# EasyEDA Pro project ProPrj_立创·庐山派K230开发板-MIPI转HDMI扩展板.epro

# Schematic 原理图

## Sheets
1 Interface&Power: Board Name: 【1】K230开发板-HDMI扩展板; Create Date: 2024-07-29; Page Name: Interface&Power; Project Name: 【K230】开发板; Schematic Name: HDMI扩展板原理图; Update Date: 2024-09-26
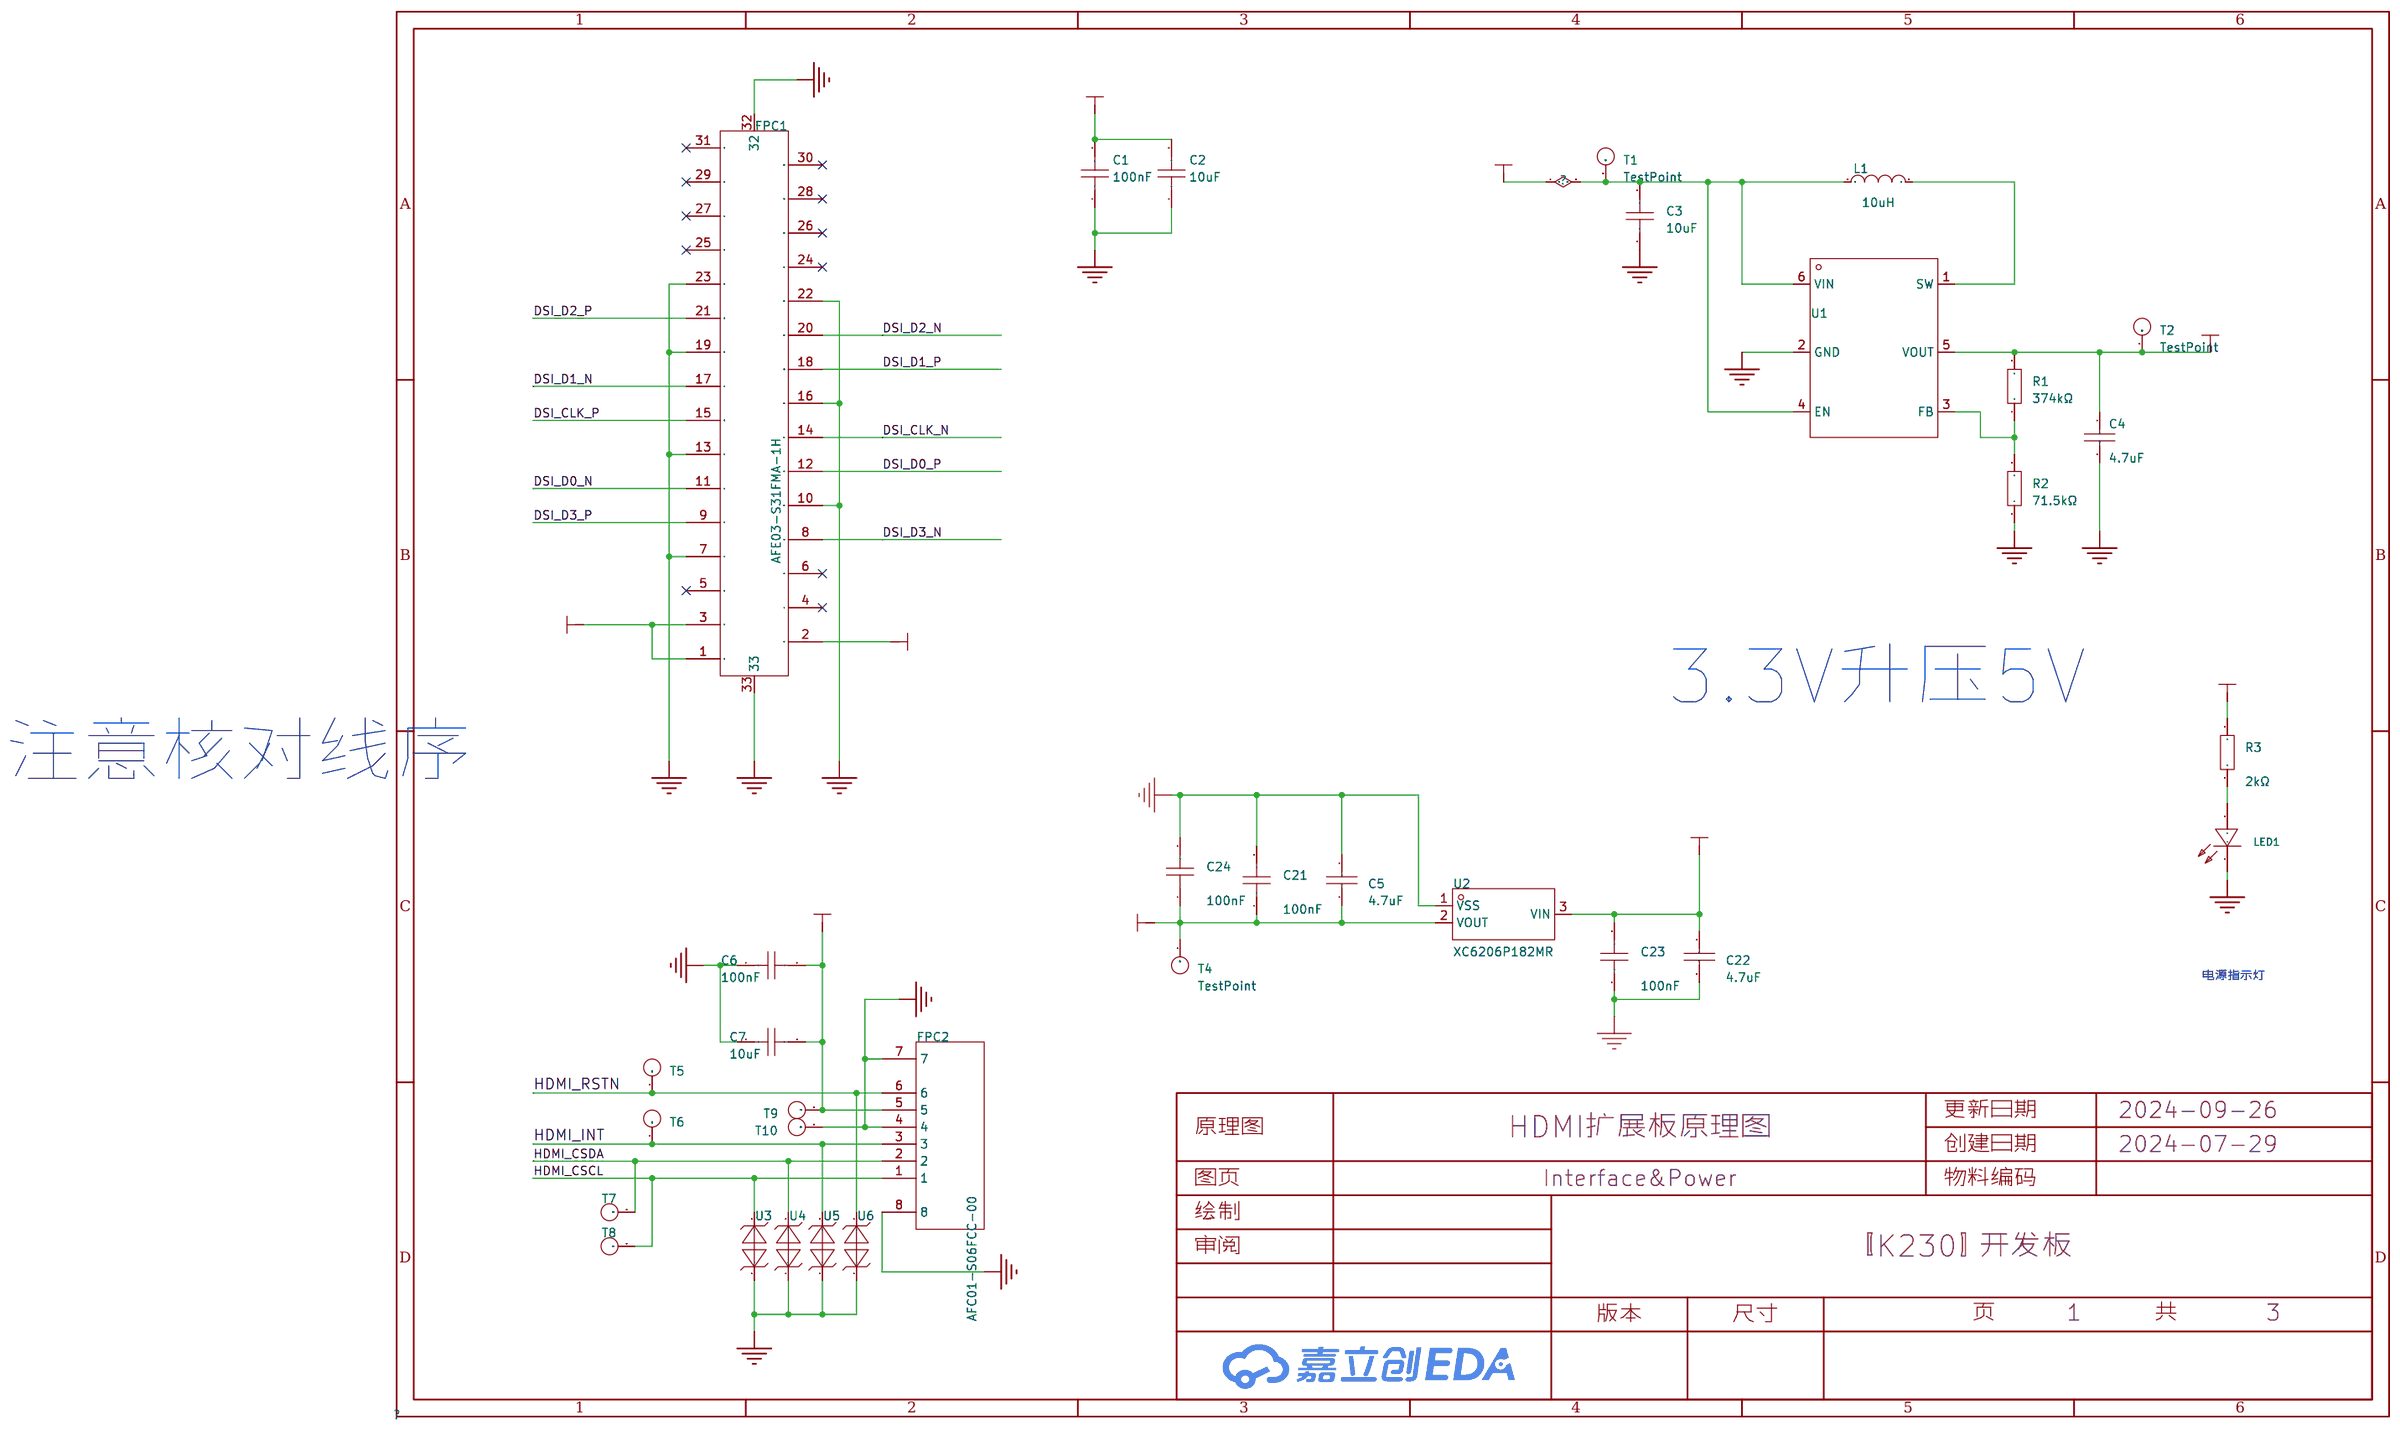
[diagram p0: Interface&Power]
2 LT9611: Create Date: 2024-08-09
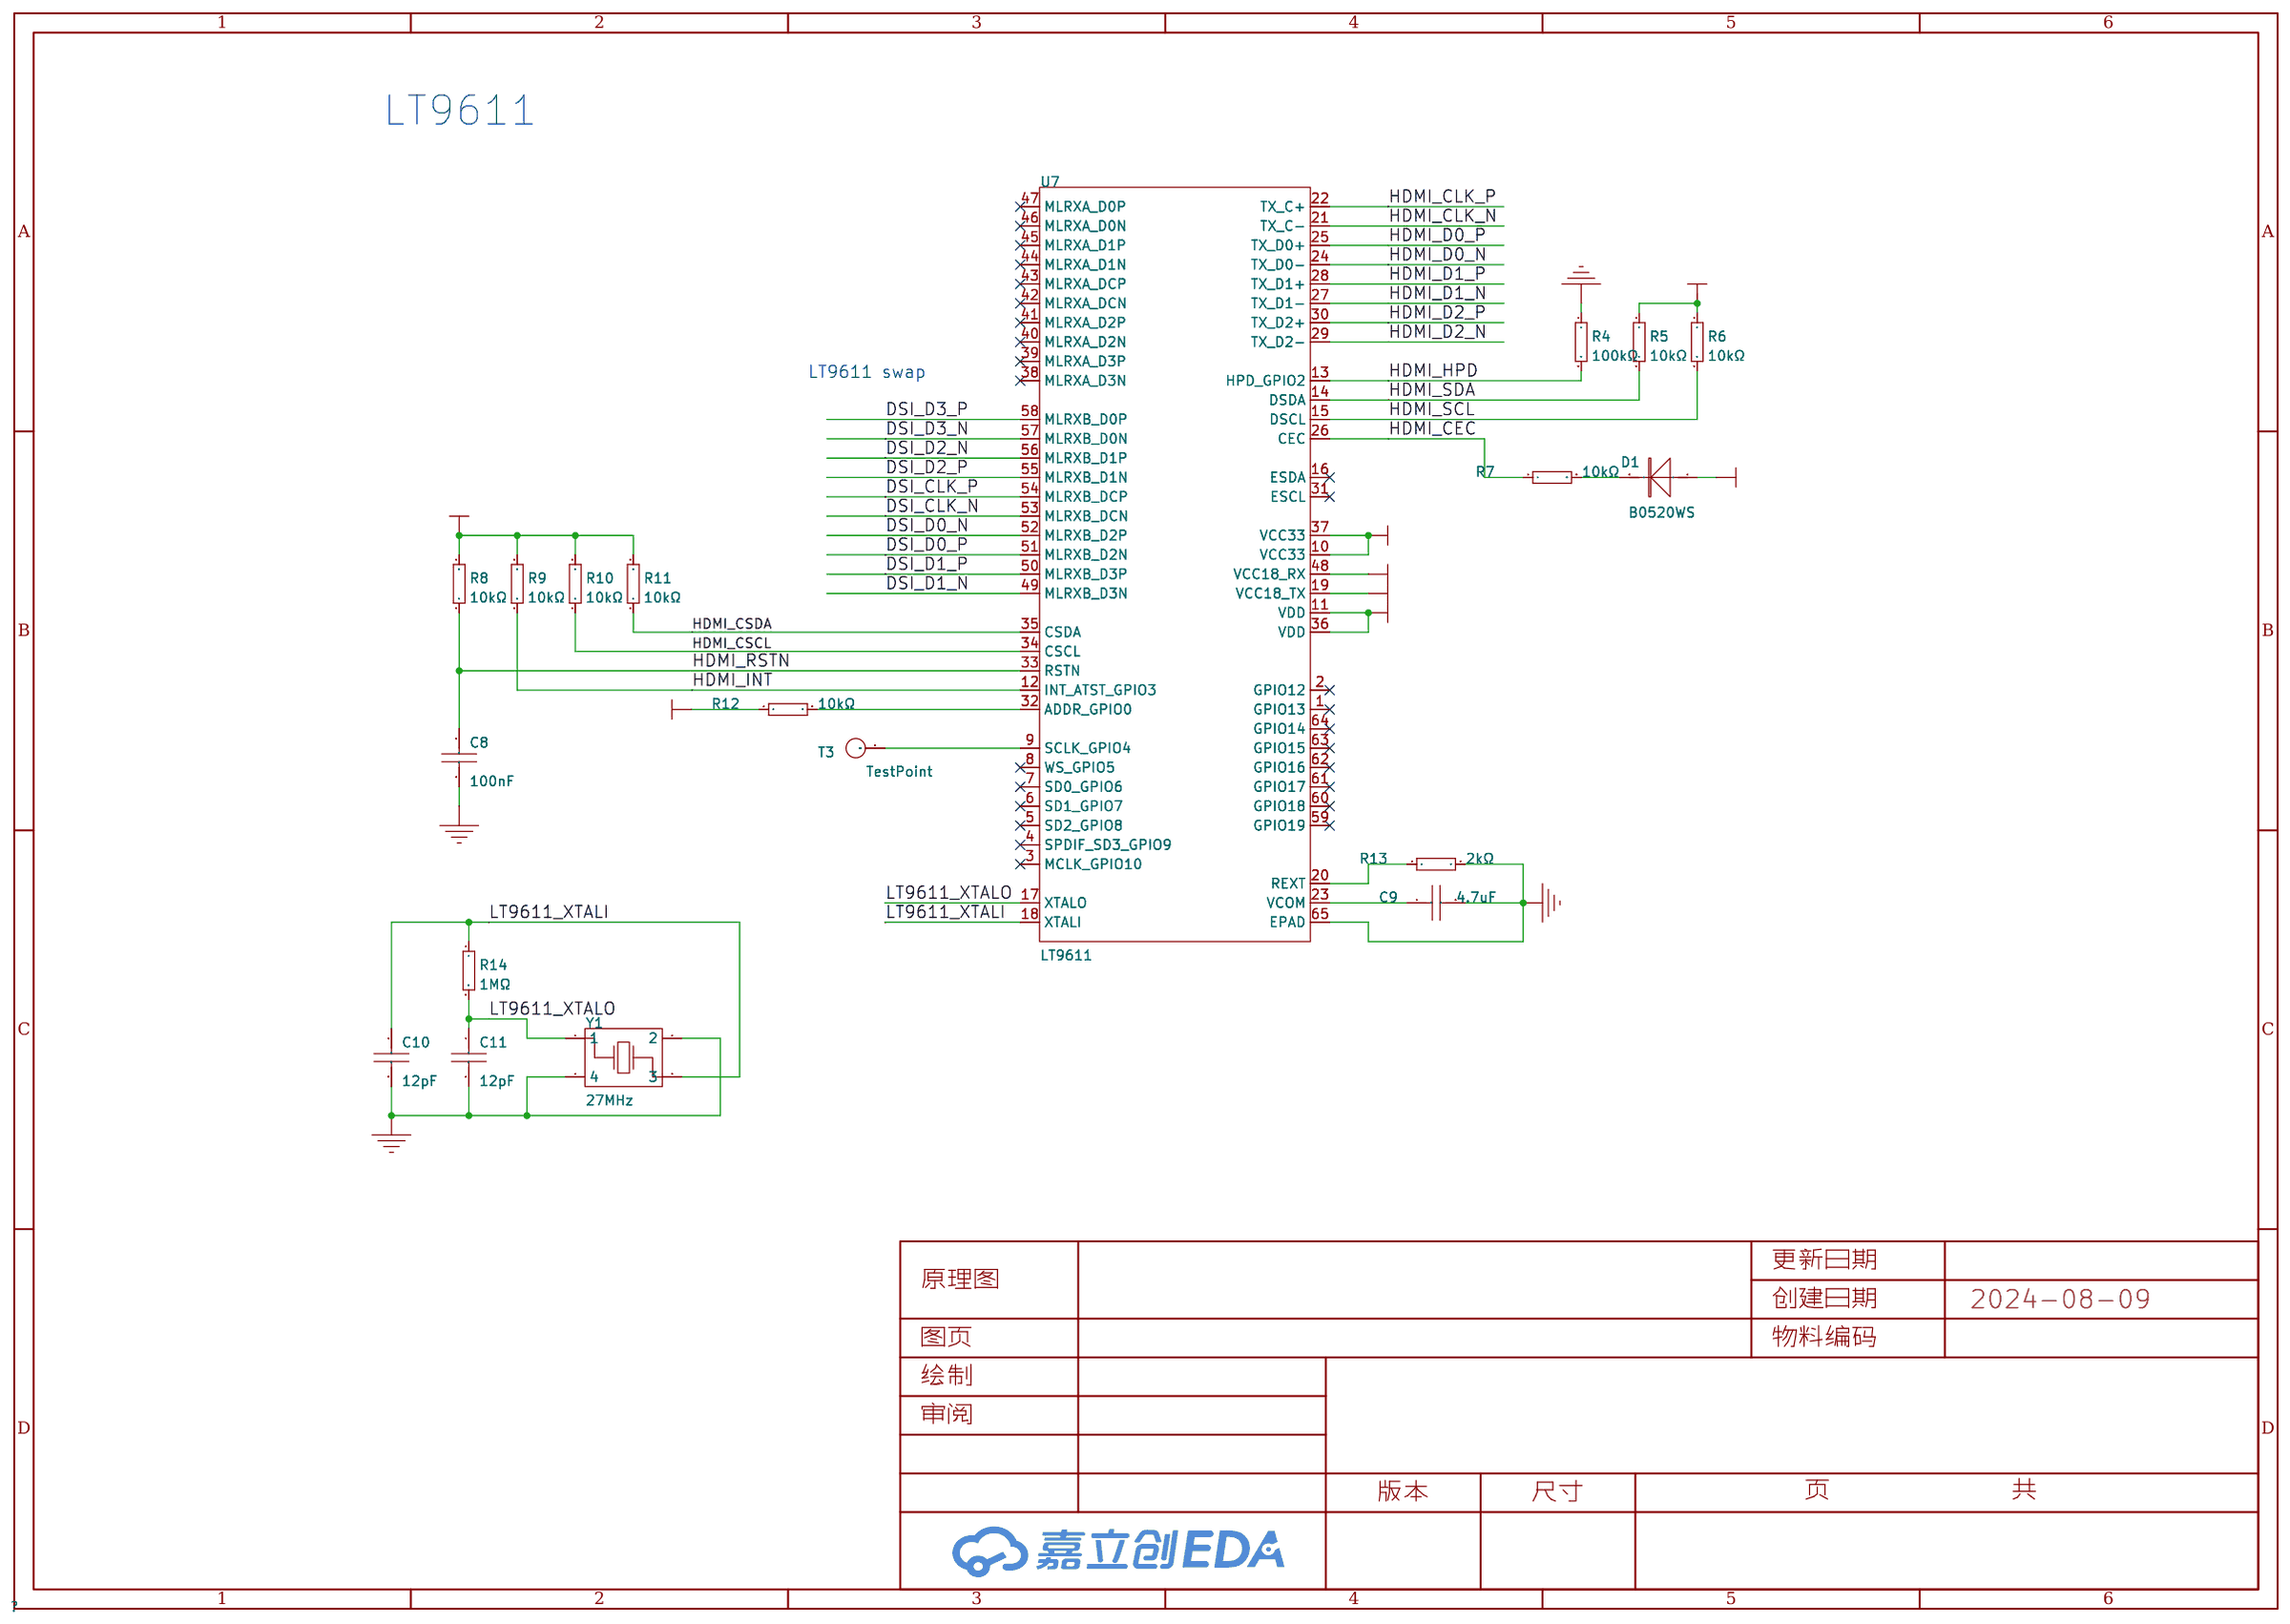
[diagram p1: LT9611]
3 HDMI: Create Date: 2024-08-09
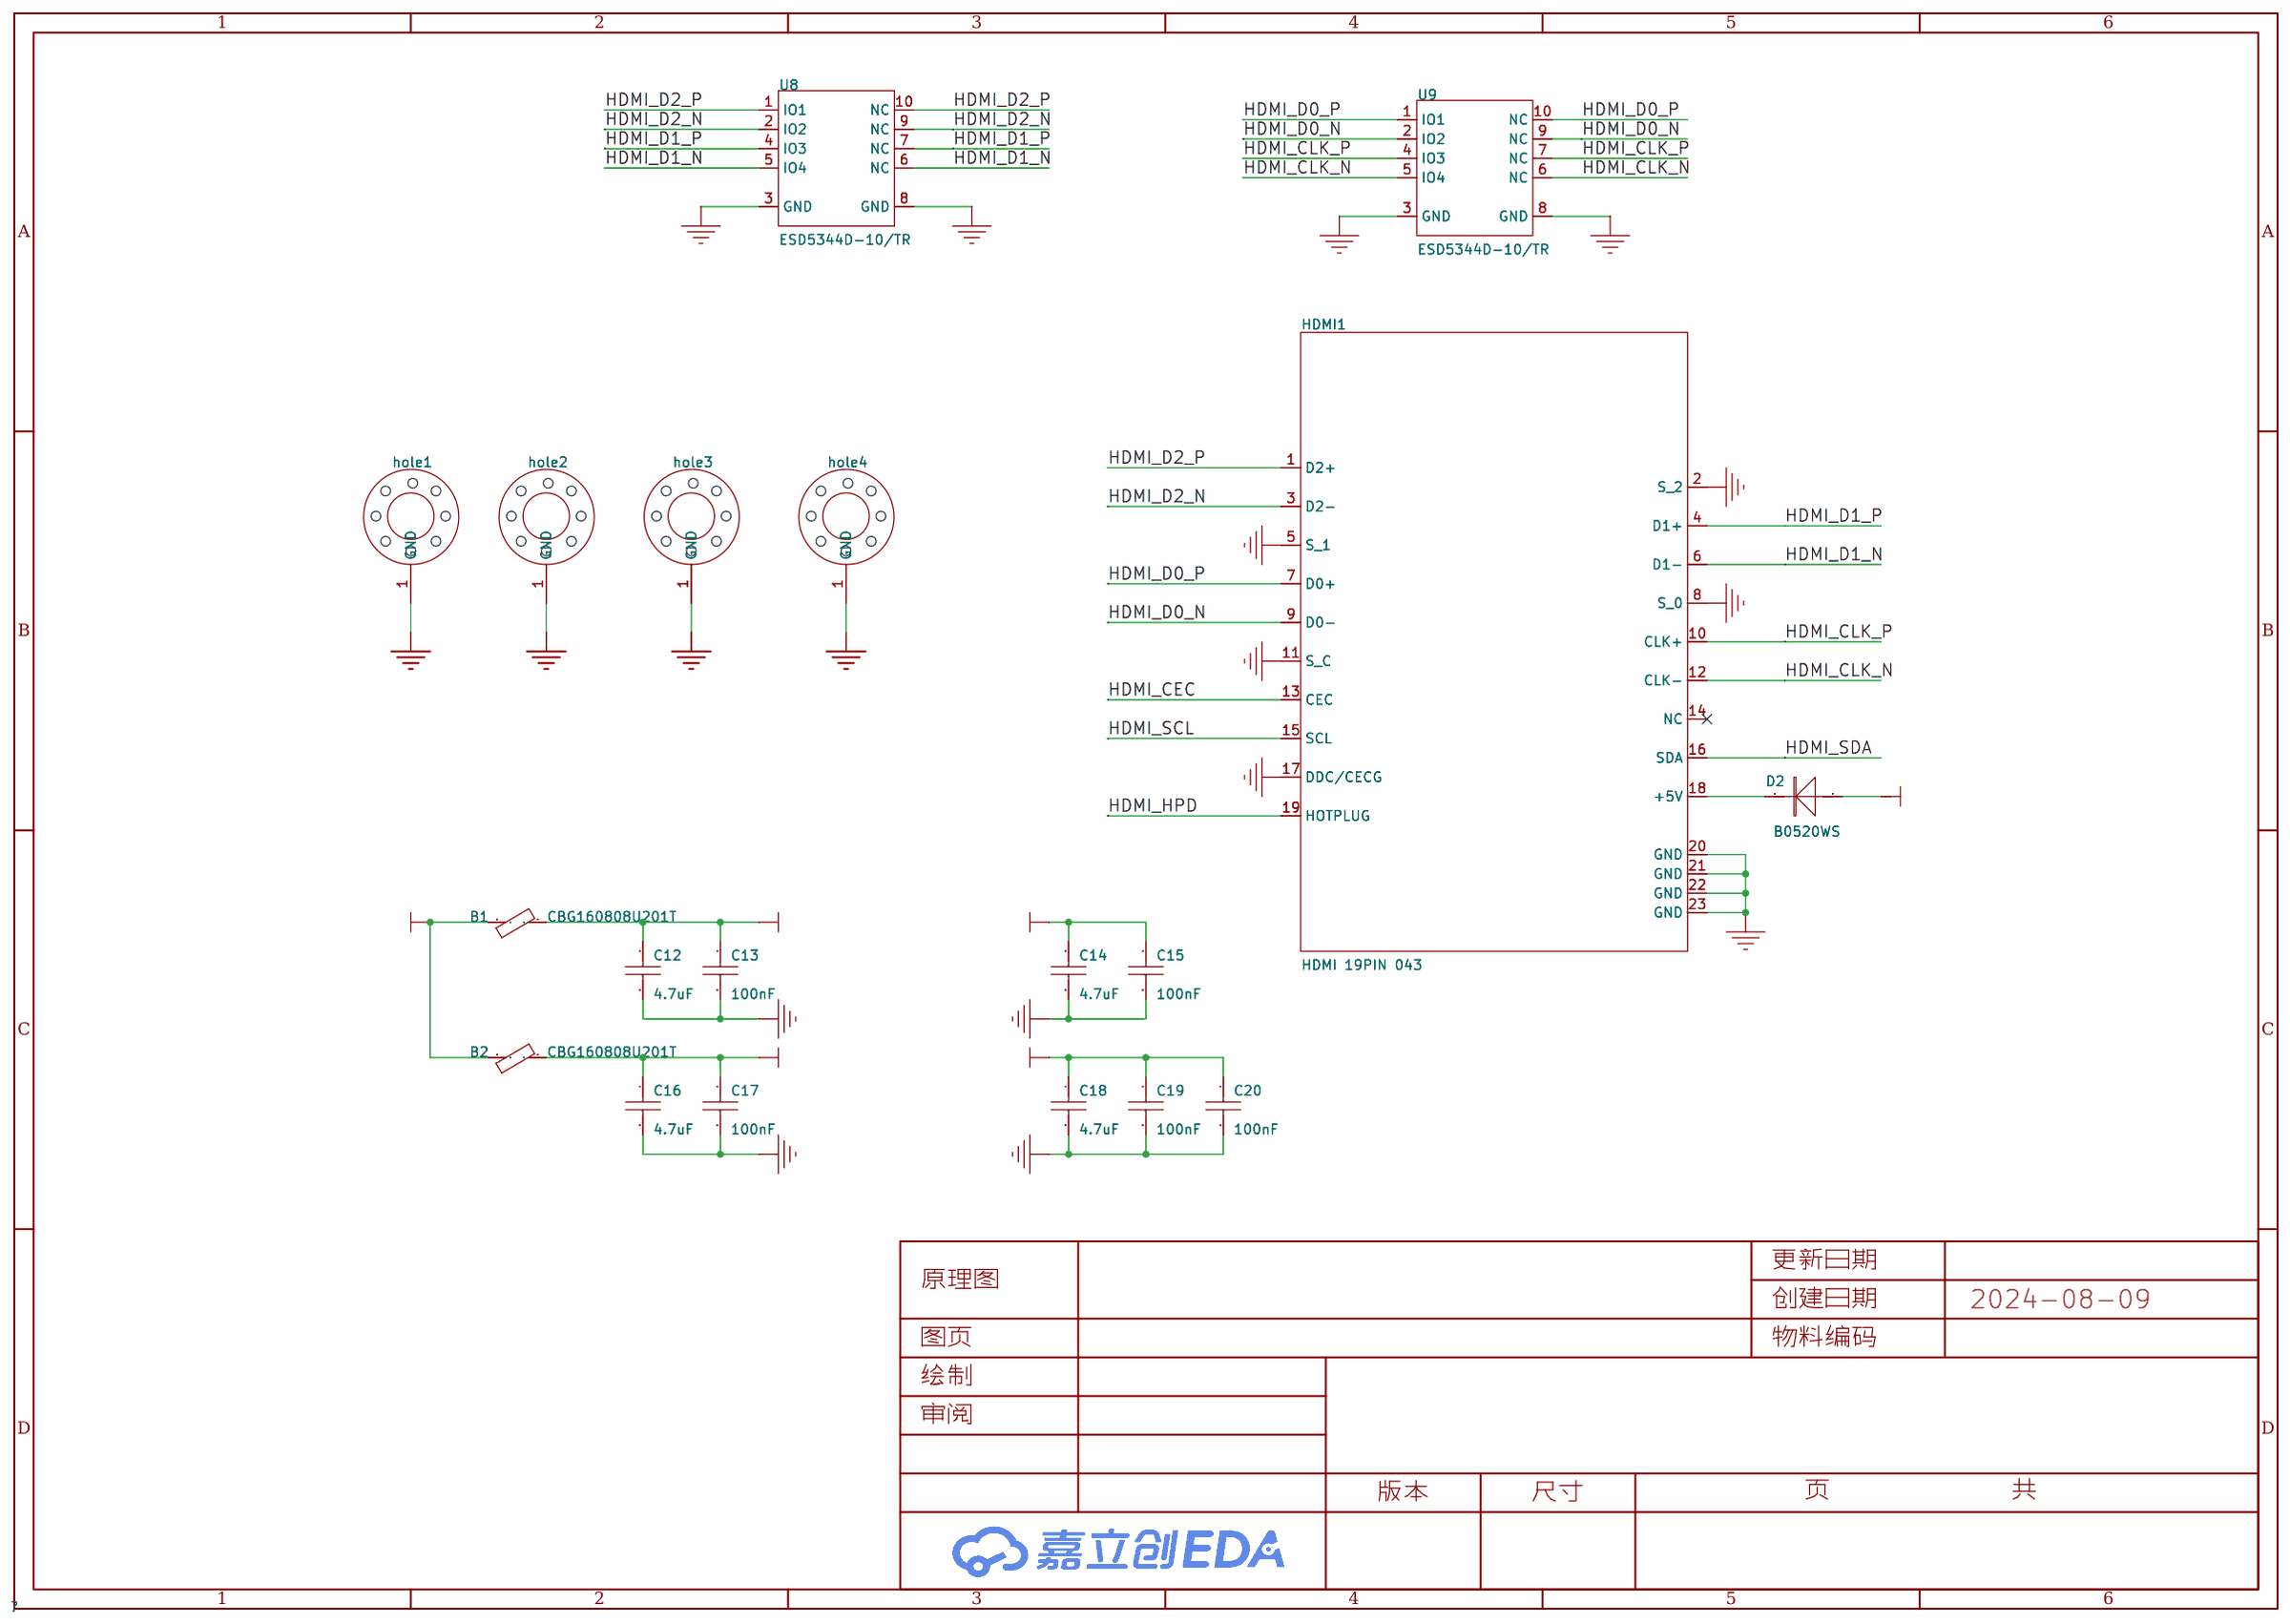
[diagram p2: HDMI]

## Parts
sheet HDMI
B1  CBG160808U201T  [L0603]
B2  CBG160808U201T  [L0603]
C12  4.7uF  [R0603]
C13  100nF  [R0603]
C14  4.7uF  [R0603]
C15  100nF  [R0603]
C16  4.7uF  [R0603]
C17  100nF  [R0603]
C18  4.7uF  [R0603]
C19  100nF  [R0603]
C20  100nF  [R0603]
D2  B0520WS  [SOD-323_L1.7-W1.3-LS2.6-RD-1]
HDMI1  HDMI 19PIN 043  [HDMI-SMD_HDMI-19PIN-043]
hole1  M3  [m3 125x300]
hole2  M3  [m3 125x300]
hole3  M3  [m3 125x300]
hole4  M3  [m3 125x300]
U8  ESD5344D-10/TR  [DFN2510-10_L2.5-W1.0-P0.50-BL]
U9  ESD5344D-10/TR  [DFN2510-10_L2.5-W1.0-P0.50-BL]
sheet Interface&Power
C1  100nF  [R0603]
C2  10uF  [R0603]
C3  10uF  [R0805]
C4  4.7uF  [R0805]
C5  4.7uF  [R0805]
C6  100nF  [R0603]
C7  10uF  [R0603]
C21  100nF  [R0805]
C22  4.7uF  [R0805]
C23  100nF  [R0805]
C24  100nF  [R0805]
FPC1  AFE03-S31FMA-1H  [FPC-SMD_P0.30-31P_FGS-XJ-H1.0]
FPC2  AFC01-S06FCC-00  [FPC-SMD_AFC01-S06FCC-00]
L1  10uH  [IND-SMD_L2.5-W2.0]
LED1  NCD0603R1  [LED0603-RD_RED]
R1  374kΩ  [R0805]
R2  71.5kΩ  [R0805]
R3  2kΩ  [R0603]
T1  TestPoint  [TestPoint_D30]
T2  TestPoint  [TestPoint_D30]
T4  TestPoint  [TestPoint_D30]
T5  TestPoint  [TestPoint_D30]
T6  TestPoint  [TestPoint_D30]
T7  TestPoint  [TestPoint_D30]
T8  TestPoint  [TestPoint_D30]
T9  TestPoint  [TestPoint_D30]
T10  TestPoint  [TestPoint_D30]
U1  TLV61046ADBVR  [SOT-23-6_L2.9-W1.6-P0.95-LS2.8-BL]
U2  XC6206P182MR  [SOT-23-3_L3.0-W1.7-P0.95-LS2.9-BR]
U3  0603ESDA-05N  [D0603-BI]
U4  0603ESDA-05N  [D0603-BI]
U5  0603ESDA-05N  [D0603-BI]
U6  0603ESDA-05N  [D0603-BI]
sheet LT9611
C8  100nF  [R0603]
C9  4.7uF  [R0603]
C10  12pF  [R0402]
C11  12pF  [R0402]
D1  B0520WS  [SOD-323_L1.7-W1.3-LS2.6-RD-1]
R4  100kΩ  [R0603]
R5  10kΩ  [R0603]
R6  10kΩ  [R0603]
R7  10kΩ  [R0603]
R8  10kΩ  [R0603]
R9  10kΩ  [R0603]
R10  10kΩ  [R0603]
R11  10kΩ  [R0603]
R12  10kΩ  [R0603]
R13  2kΩ  [R0603]
R14  1MΩ  [R0402]
T3  TestPoint  [TestPoint_D30]
U7  LT9611  [QFN_64_7P5X7P5_0P4]
Y1  27MHz  [OSC-SMD_4P-L3.2-W2.5-BL]

## Library data of the parts
B1 B2 = CBG160808U201T: 标称阻抗@测试频率:200Ω@100MHz;直流电阻(RDC):-;; LCSC Part Name: 单路 0603磁珠 阻抗200Ω@100MHz; Supplier Part: C401502; Manufacturer: FH(风华); Supplier Footprint: 0603; JLCPCB Part Class: Extended Part; Datasheet: https://atta.szlcsc.com/upload/public/pdf/source/20181120/C333978_3E581FB55966932B05020139ABDE8E01.pdf; Supplier: LCSC; Impedance @ Frequency: 200Ω@100MHz; Circuits: 1; Tolerance: ±25%
C9 C12 C14 C16 C18 = CL10A475KP8NNNC: 容值:4.7uF;精度:±10%;额定电压:10V;材质(温度系数):X5R;; LCSC Part Name: 4.7uF ±10% 10V; Supplier Part: C1705; Manufacturer: SAMSUNG(三星); Supplier Footprint: 0603; JLCPCB Part Class: Extended Part; Datasheet: https://atta.szlcsc.com/upload/public/pdf/source/20160218/1457707763339.pdf; Supplier: LCSC; Tolerance: ±10%; Voltage Rated: 10V; Temperature Coefficient: X5R
C8 C13 C15 C17 C19 C20 = CC0603KRX7R9BB104: 容值:100nF;精度:±10%;额定电压:50V;材质(温度系数):X7R;; LCSC Part Name: 100nF ±10% 50V; Supplier Part: C14663; Manufacturer: YAGEO(国巨); Supplier Footprint: 0603; JLCPCB Part Class: Basic Part; Datasheet: https://atta.szlcsc.com/upload/public/pdf/source/20180910/C282072_33301C7F631E79921B82A8DAC6BCC5B3.pdf; Supplier: LCSC; Tolerance: ±10%; Voltage Rated: 50V; Temperature Coefficient: X7R
D1 D2 = B0520WS_C7502696: 二极管配置:独立式;正向压降(Vf):390mV@500mA;直流反向耐压(Vr):20V;平均整流电流(Io):500mA;; LCSC Part Name: 电压:20V 电流:500mA; Supplier Part: C7502696; Manufacturer: 宏迦橙; Supplier Footprint: SOD-323; JLCPCB Part Class: Extended Part; Datasheet: https://atta.szlcsc.com/upload/public/pdf/source/20230828/D03BBC301FC735629C9CE389FB922DA4.pdf; Supplier: LCSC; Diode Configuration: 独立式; Forward Voltage (Vf@If): 390mV@500mA; Reverse Voltage (Vr): 20V; Average Rectified Current (Io): 500mA; Reverse Leakage Current (Ir): 250uA; Peak forward surge current: 5.5A; Origin Footprint 1: SOD-323; Design Item ID: DIODE; Library Name: ZX_MyLib; LC_CODE: C475610; Origin Footprint 2: SMT_DIODE_SOD_123
HDMI1 = HDMI 19PIN 043: 连接器类型:HDMI;公母:母;总PIN位数:19P;安装方式:卧贴;排数:-;额定电流:300mA;工作温度范围:-55℃~+85℃;; LCSC Part Name: HDMI 母 P数:19P; Supplier Part: C2858275; Manufacturer: SHOU HAN(首韩); Supplier Footprint: SMD; JLCPCB Part Class: Extended Part; Datasheet: https://atta.szlcsc.com/upload/public/pdf/source/20210728/C2858275_DF299413048A9CF092C2A61AB97004F4.pdf; Supplier: LCSC; Connector Type: HDMI; Gender: 母; Number of Pins: 19P; Mounting Style: 卧贴; Current Rating (Max): 300mA; Operating Temperature Range: -55℃~+85℃; Design Item ID: HDMI-MH; Library Name: ZX_MyLib; LC_CODE: C2858275
hole1-hole4 = m3_梅花螺丝孔: 梅花螺丝孔; Check: false
U8 U9 = ESD5344D-10/TR: 防静电IC TPD4E05U06DQAR; Supplier Part: C239666; Manufacturer: WILLSEMI(韦尔); Supplier Footprint: DFN2510-10; JLCPCB Part Class: Extended Part; Datasheet: https://atta.szlcsc.com/upload/public/pdf/source/20201027/C239666_8A6B927B23BDBC1DC9A5C33CCBB98BF5.pdf; Supplier: LCSC; Design Item ID: TPD4E05U06; Library Name: ZX_MyLib; LC_CODE: C587162
C1 C6 = CC0603KRX7R9BB104: 容值:100nF;精度:±10%;额定电压:50V;材质(温度系数):X7R;; LCSC Part Name: 100nF ±10% 50V; Supplier Part: C14663; Manufacturer: YAGEO(国巨); Supplier Footprint: 0603; JLCPCB Part Class: Basic Part; Datasheet: https://atta.szlcsc.com/upload/public/pdf/source/20180910/C282072_33301C7F631E79921B82A8DAC6BCC5B3.pdf; Supplier: LCSC; Tolerance: ±10%; Voltage Rated: 50V; Temperature Coefficient: X7R; Check: false
C2 C7 = CL10A106KP8NNNC: 容值:10uF;精度:±10%;额定电压:10V;材质(温度系数):X5R;; LCSC Part Name: 10uF ±10% 10V; Supplier Part: C19702; Manufacturer: SAMSUNG(三星); Supplier Footprint: 0603; JLCPCB Part Class: Basic Part; Datasheet: https://atta.szlcsc.com/upload/public/pdf/source/20160218/1457707763339.pdf; Supplier: LCSC; Tolerance: ±10%; Voltage Rated: 10V; Temperature Coefficient: X5R
C3 = CL21A106KPFNNNE: 容值:10uF;精度:±10%;额定电压:10V;材质(温度系数):X5R;; LCSC Part Name: 10uF ±10% 10V; Supplier Part: C17024; Manufacturer: SAMSUNG(三星); Supplier Footprint: 0805; JLCPCB Part Class: Extended Part; Datasheet: https://atta.szlcsc.com/upload/public/pdf/source/20160218/1457707763339.pdf; Supplier: LCSC; Tolerance: ±10%; Voltage Rated: 10V; Temperature Coefficient: X5R
C4 C5 C22 = CL21A475KAQNNNE: 容值:4.7uF;精度:±10%;额定电压:25V;材质(温度系数):X5R;; LCSC Part Name: 4.7uF ±10% 25V; Supplier Part: C1779; Manufacturer: SAMSUNG(三星); Supplier Footprint: 0805; JLCPCB Part Class: Basic Part; Datasheet: https://atta.szlcsc.com/upload/public/pdf/source/20160218/1457707763339.pdf; Supplier: LCSC; Tolerance: ±10%; Voltage Rated: 25V; Temperature Coefficient: X5R; Check: false
C21 C23 C24 = CC0805KRX7R9BB104: 容值:100nF;精度:±10%;额定电压:50V;材质(温度系数):X7R;; LCSC Part Name: 100nF ±10% 50V; Supplier Part: C49678; Manufacturer: YAGEO(国巨); Supplier Footprint: 0805; JLCPCB Part Class: Basic Part; Datasheet: https://atta.szlcsc.com/upload/public/pdf/source/20180224/C181747_15194369449651363981.pdf; Supplier: LCSC; Tolerance: ±10%; Voltage Rated: 50V; Temperature Coefficient: X7R; Check: false
FPC1 = AFE03-S31FMA-1H: 间距:0.3mm;触点数量:31;锁定特性:翻盖式;安装类型:卧贴;触点类型:下接;; LCSC Part Name: FPC 0.3 MM 31P 翻盖式 H1.0mm 下接; Supplier Part: C262545; Manufacturer: JS(钜硕电子); Supplier Footprint: P=0.3mm; JLCPCB Part Class: Extended Part; Datasheet: https://atta.szlcsc.com/upload/public/pdf/source/20180810/C262545_77B457498850318D655D6A9CA7AC22AD.pdf; Supplier: LCSC; Pitch: 0.3mm; Number of Contacts: 31; Locking Feature: 翻盖式; Mounting Type: 卧贴; Contact Type: 下接; Height Above Board: 1mm; FFC, FCB Thickness: 0.2mm~0.2mm
FPC2 = AFC01-S06FCC-00: 间距:0.5mm;触点数量:6;锁定特性:翻盖式;安装类型:卧贴;触点类型:下接;; LCSC Part Name: 0.5mm翻盖6P; Supplier Part: C262262; Manufacturer: JS(钜硕电子); Supplier Footprint: P=0.5mm; JLCPCB Part Class: Extended Part; Datasheet: https://atta.szlcsc.com/upload/public/pdf/source/20180810/C262262_206E24848442025CB909F073CC69569A.pdf; Supplier: LCSC; Pitch: 0.5mm; Number of Contacts: 6; Locking Feature: 翻盖式; Mounting Type: 卧贴; Contact Type: 下接; Height Above Board: 2mm; FFC, FCB Thickness: 0.3mm~0.3mm
L1 = FTC252012S100MBCA: 电感值:10uH;精度:±20%;额定电流:1.2A;饱和电流(Isat):1.6A;类型:一体成型电感;; LCSC Part Name: 10uH ±20% 1.6A; Supplier Part: C5832376; Manufacturer: cjiang(长江微电); Supplier Footprint: SMD,2x2.5mm; JLCPCB Part Class: 扩展库; Datasheet: https://atta.szlcsc.com/upload/public/pdf/source/20230602/8FFEDA9C0247A92A0D4B67554BFE4091.pdf; Supplier: LCSC; Tolerance: ±20%; Rated Current: 1.2A; Saturation Current (Isat): 1.6A; DC Resistance (DCR): 330mΩ; Type: 一体成型电感
LED1 = NCD0603R1_C84263: 灯头类型:-;发光颜色:红色;正向电压(VF):1.6V~2.6V;功率:65mW;正向电流:20mA;主波长:615nm~630nm;二极管配置:独立二极管;透镜颜色:无色透明透镜;色温:-;发光强度:80mcd~220mcd;发光角度:130°;载带方式:-;工作温度:-30℃~+85℃;; Supplier Part: C84263; Manufacturer: 国星光电; Supplier Footprint: 0603; JLCPCB Part Class: Extended Part; Datasheet: https://atta.szlcsc.com/upload/public/pdf/source/20200820/C84263_DABC6A75E58F576973B407FDBA283D60.pdf; Supplier: LCSC; Emitted Color: 红色; Forward Voltage (VF): 1.6V~2.6V; Power Dissipation: 65mW; Forward Current: 20mA; Dominant Wavelength: 615nm~630nm; Diode Configuration: 独立二极管; Lens Color: 无色透明透镜; Luminous Intensity: 80mcd~220mcd; Viewing Angle: 130°; Operating Temperature: -30℃~+85℃
R1 = WR08X3743FTL: 电阻类型:厚膜电阻;阻值:374kΩ;精度:±1%;功率:125mW;最大工作电压:150V;温度系数:±100ppm/℃;; LCSC Part Name: 厚膜电阻 374kΩ ±1% 125mW; Supplier Part: C367962; Manufacturer: Walsin(华新科); Supplier Footprint: 0805; JLCPCB Part Class: Extended Part; Datasheet: https://atta.szlcsc.com/upload/public/pdf/source/20191217/C470037_D99261402F77DA8B1D609223749D445A.pdf; Supplier: LCSC; Type: 厚膜电阻; Tolerance: ±1%; Power(Watts): 125mW; Overload Voltage (Max): 150V; Temperature Coefficient: ±100ppm/℃; Operating Temperature Range: -55℃~+155℃
R2 = 0805W8F7152T5E: 电阻类型:厚膜电阻;阻值:71.5kΩ;精度:±1%;功率:125mW;最大工作电压:150V;温度系数:±100ppm/℃;; LCSC Part Name: 71.5kΩ ±1% 125mW 厚膜电阻; Supplier Part: C17811; Manufacturer: UNI-ROYAL(厚声); Supplier Footprint: 0805; JLCPCB Part Class: Extended Part; Datasheet: https://atta.szlcsc.com/upload/public/pdf/source/20200306/C422600_1E6D84923E4A46A82E41ADD87F860B5C.pdf; Supplier: LCSC; Type: 厚膜电阻; Tolerance: ±1%; Power(Watts): 125mW; Overload Voltage (Max): 150V; Temperature Coefficient: ±100ppm/℃; Operating Temperature Range: -55℃~+155℃
R3 R13 = 0603WAJ0202T5E: 电阻类型:厚膜电阻;阻值:2kΩ;精度:±5%;功率:100mW;最大工作电压:75V;温度系数:±100ppm/℃;; LCSC Part Name: 2kΩ ±5% 100mW 厚膜电阻; Supplier Part: C25590; Manufacturer: UNI-ROYAL(厚声); Supplier Footprint: 0603; JLCPCB Part Class: Extended Part; Datasheet: https://atta.szlcsc.com/upload/public/pdf/source/20200306/C422600_1E6D84923E4A46A82E41ADD87F860B5C.pdf; Supplier: LCSC; Type: 厚膜电阻; Tolerance: ±5%; Power(Watts): 100mW; Overload Voltage (Max): 75V; Temperature Coefficient: ±100ppm/℃; Operating Temperature Range: -55℃~+155℃
T1-T10 = TestPoint: Origin Footprint 2: TestPoint_D40; Origin Footprint 3: TestHole_D60d30; Library Name: ZX_MyLib
U1 = TLV61046ADBVR: 功能类型:升压型;输出类型:可调;输入电压:1.8V~5.5V;输出电压:3.3V~28V;输出电流(最大值):-;; Supplier Part: C464815; Manufacturer: TI(德州仪器); Supplier Footprint: SOT-23-6; JLCPCB Part Class: 扩展库; Datasheet: https://www.ti.com/cn/lit/gpn/tlv61046a; Supplier: LCSC; Function: 升压型; Output Type: 可调; Input Voltage: 1.8V~5.5V; Output Voltage: 3.3V~28V; Switching Frequency: 1.05MHz; Operating Temperature: -40℃~+125℃@(TJ); Number of Outputs: 1; Topology: 升压式; Switch tube (built-in/external): 内置
U2 = XC6206P182MR_C347373: 输出类型:固定;最大输入电压:8V;输出电压:1.8V;输出电流:250mA;电源纹波抑制比(PSRR):40dB@(1kHz);输出极性:正;; LCSC Part Name: 输入8V 输出1.8V 250mA; Supplier Part: C347373; Manufacturer: UMW(友台半导体); Supplier Footprint: SOT-23; JLCPCB Part Class: 扩展库; Datasheet: https://atta.szlcsc.com/upload/public/pdf/source/20231109/6B10DA60E52FC900BF97E3EFEB5D6341.pdf; Supplier: LCSC; Output Type: 固定; Maximum Input Voltage: 8V; Output Voltage: 1.8V; Output Current: 250mA; Power Supply Rejection Ratio (PSRR): 40dB@(1kHz); Dropout Voltage: 280mV@(50mA); Output Polarity: 正; Number of Outputs: 1
U3-U6 = 0603ESDA-05N: 极性:双向;反向截止电压(Vrwm):5V;最大钳位电压:50V;; LCSC Part Name: 双向ESD; Supplier Part: C316054; Manufacturer: BORN(伯恩半导体); Supplier Footprint: 0603; JLCPCB Part Class: Extended Part; Datasheet: https://atta.szlcsc.com/upload/public/pdf/source/20200528/C316054_1CC523E9CE69E41C8DD5A05C832CCD1A.pdf; Supplier: LCSC; polarity: 双向; Reverse Stand-Off Voltage (Vrwm): 5V; Maximum Clamping Voltage: 50V; Type: ESD; Check: false
C10 C11 = 0402CG120J500NT: 容值:12pF;精度:±5%;额定电压:50V;材质(温度系数):C0G;; LCSC Part Name: 12pF ±5% 50V; Supplier Part: C1547; Manufacturer: FH(风华); Supplier Footprint: 0402; JLCPCB Part Class: Basic Part; Datasheet: https://atta.szlcsc.com/upload/public/pdf/source/20200305/C486355_26A10D38EF8C2A5C37091D0039909270.pdf; Supplier: LCSC; Tolerance: ±5%; Voltage Rated: 50V; Temperature Coefficient: C0G
R4 = 0603WAF1003T5E: 电阻类型:厚膜电阻;阻值:100kΩ;精度:±1%;功率:100mW;最大工作电压:75V;温度系数:±100ppm/℃;; LCSC Part Name: 100kΩ ±1% 100mW 厚膜电阻; Supplier Part: C25803; Manufacturer: UNI-ROYAL(厚声); Supplier Footprint: 0603; JLCPCB Part Class: Basic Part; Datasheet: https://atta.szlcsc.com/upload/public/pdf/source/20200306/C422600_1E6D84923E4A46A82E41ADD87F860B5C.pdf; Supplier: LCSC; Type: 厚膜电阻; Tolerance: ±1%; Power(Watts): 100mW; Overload Voltage (Max): 75V; Temperature Coefficient: ±100ppm/℃; Operating Temperature Range: -55℃~+155℃
R5-R12 = 0603WAF1002T5E: 电阻类型:厚膜电阻;阻值:10kΩ;精度:±1%;功率:100mW;最大工作电压:75V;温度系数:±100ppm/℃;; LCSC Part Name: 厚膜电阻 10kΩ ±1% 100mW; Supplier Part: C25804; Manufacturer: UNI-ROYAL(厚声); Supplier Footprint: 0603; JLCPCB Part Class: Basic Part; Datasheet: https://atta.szlcsc.com/upload/public/pdf/source/20200306/C422600_1E6D84923E4A46A82E41ADD87F860B5C.pdf; Supplier: LCSC; Tolerance: ±1%; Power(Watts): 100mW; Overload Voltage (Max): 75V; Temperature Coefficient: ±100ppm/℃; Type: 厚膜电阻; Operating Temperature Range: -55℃~+155℃
R14 = 0402WGF1004TCE: 电阻类型:厚膜电阻;阻值:1MΩ;精度:±1%;功率:62.5mW;最大工作电压:50V;温度系数:±100ppm/℃;; LCSC Part Name: 1MΩ ±1% 62.5mW 厚膜电阻; Supplier Part: C26083; Manufacturer: UNI-ROYAL(厚声); Supplier Footprint: 0402; JLCPCB Part Class: Basic Part; Datasheet: https://atta.szlcsc.com/upload/public/pdf/source/20200306/C422600_1E6D84923E4A46A82E41ADD87F860B5C.pdf; Supplier: LCSC; Type: 厚膜电阻; Tolerance: ±1%; Power(Watts): 62.5mW; Overload Voltage (Max): 50V; Temperature Coefficient: ±100ppm/℃; Operating Temperature Range: -55℃~+155℃
U7 = LT9611: 龙讯 LT9611; Library Name: ZX_MyLib
Y1 = X322527MSB4SI: 晶振类型:贴片晶振;频率:27MHz;常温频差:±10ppm;外接负载电容:20pF;频率稳定度(全温):±20ppm;; LCSC Part Name: 27MHz ±10ppm 20pF; Supplier Part: C9008; Manufacturer: YXC(扬兴晶振); Supplier Footprint: SMD3225-4P; JLCPCB Part Class: Extended Part; Datasheet: https://atta.szlcsc.com/upload/public/pdf/source/20240329/19D5F850207469550BEB00D7DFEDBC7A.pdf; Supplier: LCSC; Crystal Type: 贴片晶振; Normal temperature Frequency Tolerance: ±10ppm; External load capacitor: 20pF; Frequency Stability(Full temperature range): ±20ppm; Operating Temperature: -40℃~+85℃

## Nets
+5V0: C4.1 D2.1(A) R1.2 R3.2 R5.1 R6.1 T2.TP(TestPoint) U1.5(VOUT)
GND: C1.1 C2.1 C3.1 C4.2 C5.1 C6.1 C7.1 C8.2 C9.2 C10.2 C11.2 C12.2 C13.2 C14.2 C15.2 C16.2 C17.2 C18.2 C19.2 C20.2 C21.2 C22.2 C23.1 C24.2 FPC1.7 FPC1.10 FPC1.13 FPC1.16 FPC1.19 FPC1.22 FPC1.23 FPC1.32 FPC1.33 FPC2.4 FPC2.7 FPC2.8 HDMI1.2(S) HDMI1.5(S_1) HDMI1.8(S_0) HDMI1.11(S_C) HDMI1.17(DDC/CECG) HDMI1.20(GND) HDMI1.21(GND) HDMI1.22(GND) HDMI1.23(GND) hole1.1(GND) hole2.1(GND) hole3.1(GND) hole4.1(GND) LED1.1(K) R2.1 R4.1 R13.2 T10.TP(TestPoint) U1.2(GND) U2.1(VSS) U3.1 U4.1 U5.1 U6.1 U7.65(EPAD) U8.3(GND) U8.8(GND) U9.3(GND) U9.8(GND) Y1.2 Y1.4
VDD_1V8: B1.1 B2.1 C5.2 C14.1 C15.1 C21.1 C24.1 T4.TP(TestPoint) U2.2(VOUT) U7.11(VDD) U7.36(VDD)
VDD_1V8_RX: B1.2 C12.1 C13.1 U7.48(VCC18_RX)
VDD_1V8_TX: B2.2 C16.1 C17.1 U7.19(VCC18_TX)
VDD_3V3: C1.2 C2.2 C3.2 C6.2 C7.2 C18.1 C19.1 C20.1 C22.1 C23.2 D1.1(A) FPC1.1 FPC1.2 FPC1.3 FPC2.5 L1.2 R8.1 R9.1 R10.1 R11.1 R12.1 T1.TP(TestPoint) T9.TP(TestPoint) U1.4(EN) U1.6(VIN) U2.3(VIN) U7.10(VCC33) U7.37(VCC33)
DSI_CLK_N: FPC1.14 U7.53(MLRXB_DCN)
DSI_CLK_P: FPC1.15 U7.54(MLRXB_DCP)
DSI_D0_N: FPC1.11 U7.52(MLRXB_D2P)
DSI_D0_P: FPC1.12 U7.51(MLRXB_D2N)
DSI_D1_N: FPC1.17 U7.49(MLRXB_D3N)
DSI_D1_P: FPC1.18 U7.50(MLRXB_D3P)
DSI_D2_N: FPC1.20 U7.56(MLRXB_D1P)
DSI_D2_P: FPC1.21 U7.55(MLRXB_D1N)
DSI_D3_N: FPC1.8 U7.57(MLRXB_D0N)
DSI_D3_P: FPC1.9 U7.58(MLRXB_D0P)
HDMI_CEC: HDMI1.13(CEC) R7.1 U7.26(CEC)
HDMI_CLK_N: HDMI1.12(CLK-) U7.21(TX_C-) U9.5(IO4) U9.6(NC)
HDMI_CLK_P: HDMI1.10(CLK+) U7.22(TX_C+) U9.4(IO3) U9.7(NC)
HDMI_CSCL: FPC2.1 R10.2 T8.TP(TestPoint) U3.2 U7.34(CSCL)
HDMI_CSDA: FPC2.2 R11.2 T7.TP(TestPoint) U4.2 U7.35(CSDA)
HDMI_D0_N: HDMI1.9(D0-) U7.24(TX_D0-) U9.2(IO2) U9.9(NC)
HDMI_D0_P: HDMI1.7(D0+) U7.25(TX_D0+) U9.1(IO1) U9.10(NC)
HDMI_D1_N: HDMI1.6(D1-) U7.27(TX_D1-) U8.5(IO4) U8.6(NC)
HDMI_D1_P: HDMI1.4(D1+) U7.28(TX_D1+) U8.4(IO3) U8.7(NC)
HDMI_D2_N: HDMI1.3(D2-) U7.29(TX_D2-) U8.2(IO2) U8.9(NC)
HDMI_D2_P: HDMI1.1(D2+) U7.30(TX_D2+) U8.1(IO1) U8.10(NC)
HDMI_HPD: HDMI1.19(HOTPLUG) R4.2 U7.13(HPD_GPIO2)
HDMI_INT: FPC2.3 R9.2 T6.TP(TestPoint) U5.2 U7.12(INT_ATST_GPIO3)
HDMI_RSTN: C8.1 FPC2.6 R8.2 T5.TP(TestPoint) U6.2 U7.33(RSTN)
HDMI_SCL: HDMI1.15(SCL) R6.2 U7.15(DSCL)
HDMI_SDA: HDMI1.16(SDA) R5.2 U7.14(DSDA)
LT9611_XTALI: C10.1 R14.1 U7.18(XTALI) Y1.3
LT9611_XTALO: C11.1 R14.2 U7.17(XTALO) Y1.1
$1N1708: L1.1 U1.1(SW)
$1N2490: R1.1 R2.2 U1.3(FB)
$1N7398: LED1.2(A) R3.1
$2N1397: D1.2(K) R7.2
$2N1417: R13.1 U7.20(REXT)
$2N1418: C9.1 U7.23(VCOM)
$2N1427: T3.TP(TestPoint) U7.9(SCLK_GPIO4)
$2N1432: R12.2 U7.32(ADDR_GPIO0)
$3N691: D2.2(K) HDMI1.18(+5V)

Not connected (* = marked no-connect by the designer): FPC1 4* 5* 6* 24* 25* 26* 27* 28* 29* 30* 31*; HDMI1 14(NC)*; U7 1(GPIO13)* 2(GPIO12)* 3(MCLK_GPIO10)* 4(SPDIF_SD3_GPIO9)* 5(SD2_GPIO8)* 6(SD1_GPIO7)* 7(SD0_GPIO6)* 8(WS_GPIO5)* 16(ESDA)* 31(ESCL)* 38(MLRXA_D3N)* 39(MLRXA_D3P)* 40(MLRXA_D2N)* 41(MLRXA_D2P)* 42(MLRXA_DCN)* 43(MLRXA_DCP)* 44(MLRXA_D1N)* 45(MLRXA_D1P)* 46(MLRXA_D0N)* 47(MLRXA_D0P)* 59(GPIO19)* 60(GPIO18)* 61(GPIO17)* 62(GPIO16)* 63(GPIO15)* 64(GPIO14)*

## Notes on the sheets
sheet 1
- 3.3V升压5V
- 注意核对线序
- 电源指示灯
sheet 2
- LT9611
- LT9611 swap

# Board PCB
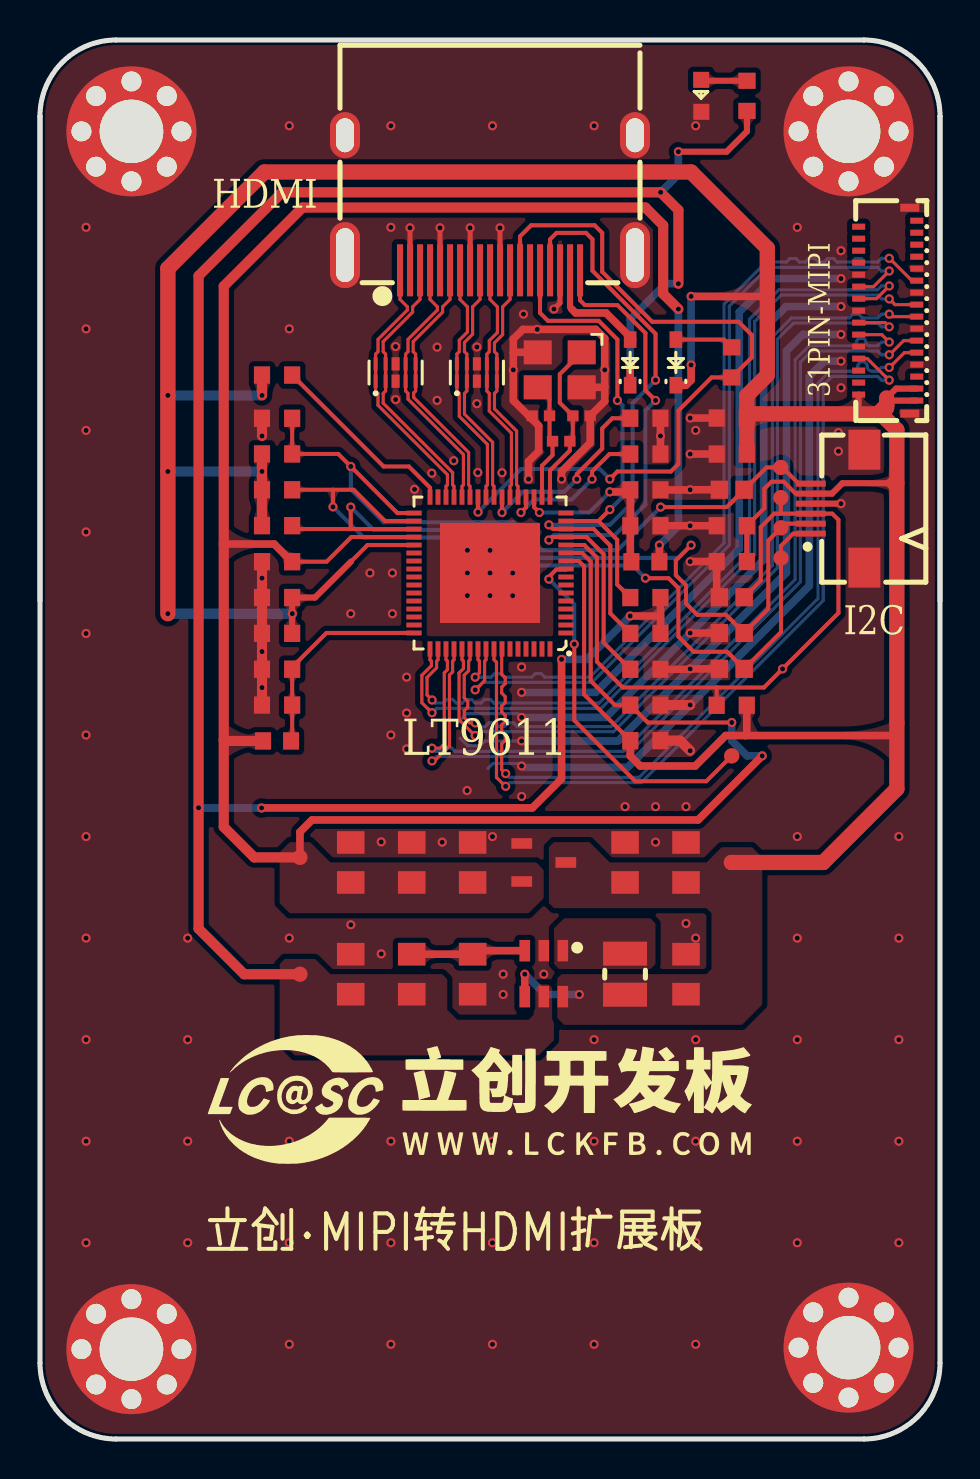
[diagram p3: board, top side]
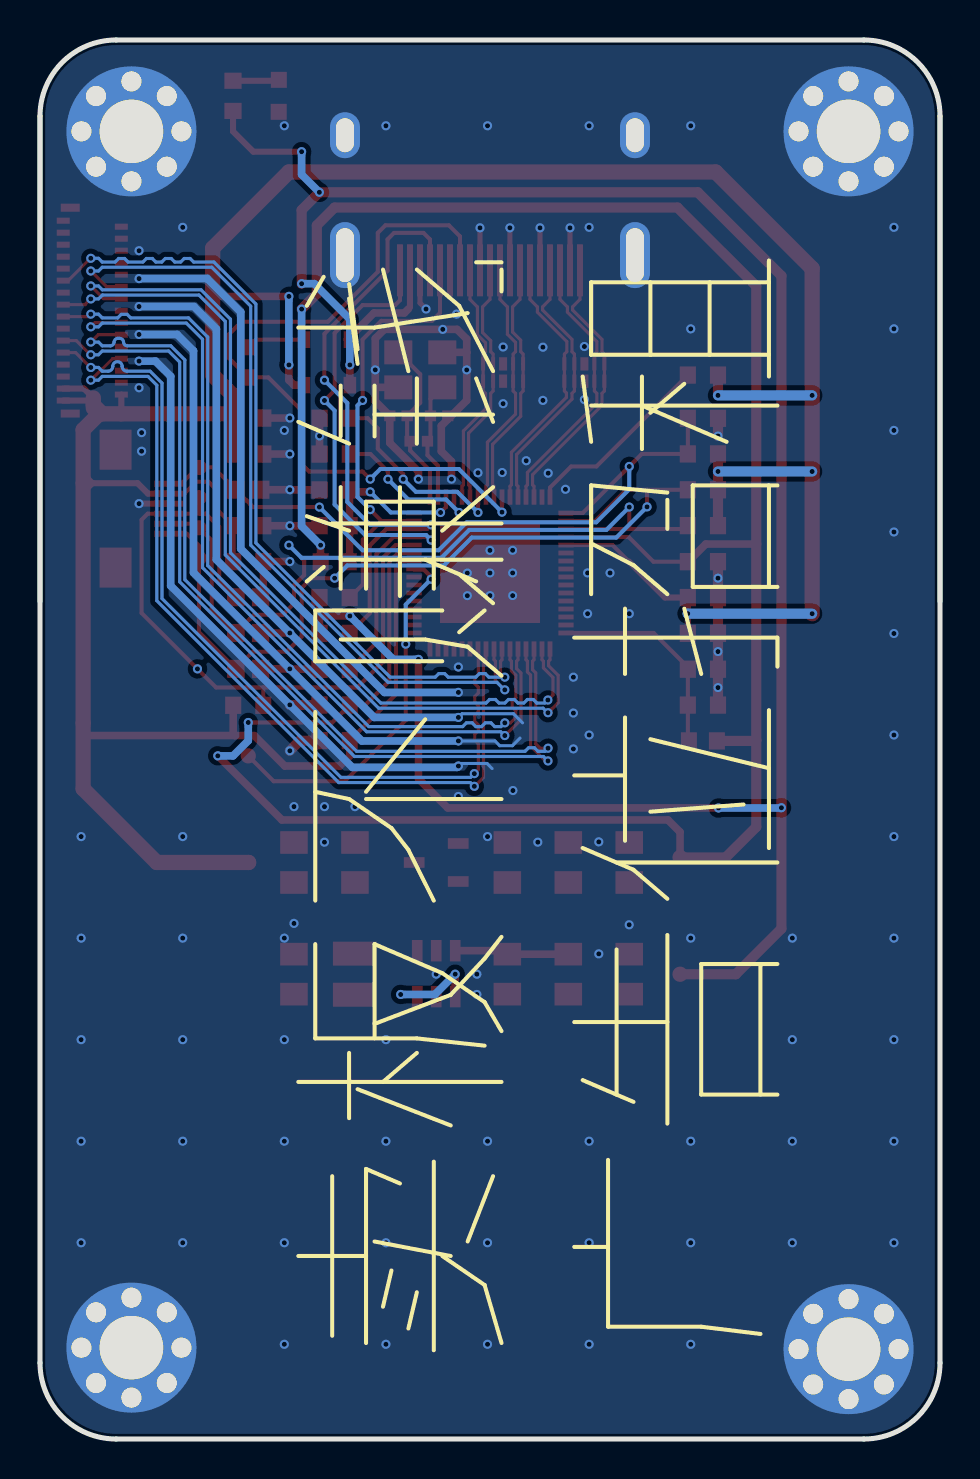
[diagram p4: board, bottom side, seen from below]

Outline 45 x 69.99 mm; copper layers: Top Layer, Bottom Layer. Coordinates in mm from the lower left corner of the outline.
Outline path: 0,66.18 0,41.91 ; 0,66.18 0,3.81 arc(1.12,1.12) 3.81,0 41.19,0 arc(43.88,1.12) 45,3.81 45,66.18 ; 0,66.18 arc(1.12,68.88) 3.81,69.99 41.19,69.99 arc(43.88,68.88) 45,66.18 ; 45,66.18 45,41.91
Stack: Top Layer 0.035mm / Dielectric1 1.51mm FR4 er 4.5 / Bottom Layer 0.035mm

## Design rules (mm)
net DSI_D3_N: DP5
net DSI_D3_P: DP5
net DSI_D0_N: DP4
net DSI_D0_P: DP4
net DSI_CLK_N: DP3
net DSI_CLK_P: DP3
net DSI_D1_N: DP2
net DSI_D1_P: DP2
net DSI_D2_N: DP1
net DSI_D2_P: DP1
net HDMI_CLK_N: DP9
net HDMI_CLK_P: DP9
net HDMI_D0_N: DP8
net HDMI_D0_P: DP8
net HDMI_D1_N: DP7
net HDMI_D1_P: DP7
net HDMI_D2_N: DP6
net HDMI_D2_P: DP6
template: 自定义配置
spacing copperThickness1oz (default): track to track 0.102, other pairs 0.152 to 0.3
spacing copperThickness2oz: track to track 0.203, other pairs 0.152 to 0.3
track width copperThickness1oz (default): min 0.152, default 0.203, max 2.54
track width copperThickness2oz: min 0.203, default 0.254, max 2.54
differential pair differentialPair (default): width min 0.157, default 0.157, max 0.157; gap min 0.102, default 0.102
via viaSize (default): diameter min 0.457, default 0.457, max 0.457; hole min 0.254, default 0.254, max 0.254

## Placement (name value [footprint] x y rotation side)
B1  CBG160808U201T  [L0603]  11.85 34.92 0 top
B2  CBG160808U201T  [L0603]  30.27 43.89 180 top
C1  100nF  [R0603]  34.59 51.08 0 top
C2  10uF  [R0603]  34.59 49.28 0 top
C3  10uF  [R0805]  32.3 23.26 270 top
C4  4.7uF  [R0805]  15.54 23.26 90 top
C5  4.7uF  [R0805]  21.63 28.84 270 top
C6  100nF  [R0603]  34.59 45.69 0 top
C7  10uF  [R0603]  34.59 43.9 0 top
C8  100nF  [R0603]  11.85 51.07 180 top
C9  4.7uF  [R0603]  30.27 51.07 0 top
C10  12pF  [R0402]  25.04 51.19 180 top
C11  12pF  [R0402]  27.08 51.19 0 top
C12  4.7uF  [R0603]  11.85 38.51 180 top
C13  100nF  [R0603]  11.85 36.72 180 top
C14  4.7uF  [R0603]  11.85 43.89 180 top
C15  100nF  [R0603]  30.27 36.72 0 top
C16  4.7uF  [R0603]  30.27 45.69 0 top
C17  100nF  [R0603]  30.27 47.48 0 top
C18  4.7uF  [R0603]  11.85 40.31 180 top
C19  100nF  [R0603]  11.85 42.1 180 top
C20  100nF  [R0603]  30.27 34.94 0 top
C21  100nF  [R0805]  18.59 28.84 90 top
C22  4.7uF  [R0805]  32.3 28.84 90 top
C23  100nF  [R0805]  29.25 28.84 270 top
C24  100nF  [R0805]  15.54 28.84 90 top
D1  B0520WS  [SOD-323_L1.7-W1.3-LS2.6-RD-1]  31.79 53.86 90 top
D2  B0520WS  [SOD-323_L1.7-W1.3-LS2.6-RD-1]  29.51 53.86 90 top
FPC1  AFE03-S31FMA-1H  [FPC-SMD_P0.30-31P_FGS-XJ-H1.0]  42.38 56.45 90 top
FPC2  AFC01-S06FCC-00  [FPC-SMD_AFC01-S06FCC-00]  39.88 46.55 90 top
HDMI1  HDMI 19PIN 043  [HDMI-SMD_HDMI-19PIN-043]  22.5 61.85 180 top
hole1  M3  [m3 125x300]  4.57 65.42 0 top
hole2  M3  [m3 125x300]  40.43 65.42 0 top
hole3  M3  [m3 125x300]  40.43 4.57 0 top
hole4  M3  [m3 125x300]  4.57 4.5 0 top
L1  10uH  [IND-SMD_L2.5-W2.0]  29.25 23.26 90 top
LED1  NCD0603R1  [LED0603-RD_RED]  33.06 67.2 90 top
R1  374kΩ  [R0805]  18.59 23.26 270 top
R2  71.5kΩ  [R0805]  21.63 23.26 90 top
R3  2kΩ  [R0603]  35.35 67.2 270 top
R4  100kΩ  [R0603]  30.27 38.51 180 top
R5  10kΩ  [R0603]  30.27 40.3 180 top
R6  10kΩ  [R0603]  30.27 42.1 180 top
R7  10kΩ  [R0603]  34.59 53.86 90 top
R8  10kΩ  [R0603]  11.85 49.28 0 top
R9  10kΩ  [R0603]  34.59 36.71 180 top
R10  10kΩ  [R0603]  11.85 47.49 0 top
R11  10kΩ  [R0603]  11.85 45.7 0 top
R12  10kΩ  [R0603]  11.85 53.23 0 top
R13  2kΩ  [R0603]  30.27 49.28 0 top
R14  1MΩ  [R0402]  26.06 49.92 0 top
T1  TestPoint  [TestPoint_D30]  34.57 28.84 0 top
T2  TestPoint  [TestPoint_D30]  13 23.25 90 top
T3  TestPoint  [TestPoint_D30]  34.59 34.18 90 top
T4  TestPoint  [TestPoint_D30]  13 29.1 0 top
T5  TestPoint  [TestPoint_D30]  37.04 48.61 0 top
T6  TestPoint  [TestPoint_D30]  37.04 47.1 0 top
T7  TestPoint  [TestPoint_D30]  37.05 45.59 0 top
T8  TestPoint  [TestPoint_D30]  37.05 44.07 0 top
U1  TLV61046ADBVR  [SOT-23-6_L2.9-W1.6-P0.95-LS2.8-BL]  25.19 23.28 180 top
U2  XC6206P182MR  [SOT-23-3_L3.0-W1.7-P0.95-LS2.9-BR]  25.19 28.84 180 top
U3  0603ESDA-05N  [D0603-BI]  34.59 38.53 0 top
U4  0603ESDA-05N  [D0603-BI]  34.59 40.32 0 top
U5  0603ESDA-05N  [D0603-BI]  34.59 42.11 0 top
U6  0603ESDA-05N  [D0603-BI]  34.59 47.49 0 top
U7  LT9611  [QFN_64_7P5X7P5_0P4]  22.5 43.33 180 top
U8  ESD5344D-10/TR  [DFN2510-10_L2.5-W1.0-P0.50-BL]  17.78 53.36 0 top
U9  ESD5344D-10/TR  [DFN2510-10_L2.5-W1.0-P0.50-BL]  21.84 53.36 0 top
Y1  27MHz  [OSC-SMD_4P-L3.2-W2.5-BL]  25.99 53.49 180 top

## Footprints (pads in the part's own frame, mm; a bottom-side part is the same pattern mirrored in y, then rotated)
D0603-BI
  rect 0.873x0.907 smd: 1(-0.622,0) 2(0.622,0)
DFN2510-10_L2.5-W1.0-P0.50-BL
  rect 0.2x0.665 smd: 1(-1,-0.433) 2(-0.5,-0.433) 4(0.5,-0.433) 5(1,-0.433) 6(1,0.433) 7(0.5,0.433) 9(-0.5,0.433) 10(-1,0.433)
  rect 0.4x0.665 smd: 3(0,-0.433) 8(0,0.433)
FPC-SMD_AFC01-S06FCC-00
  rect 0.3x1.5 smd: 1(-1.25,1.34) 2(-0.75,1.34) 3(-0.251,1.34) 4(0.25,1.34) 5(0.75,1.34) 6(1.251,1.34)
  rect 2x1.6 smd: 7(-2.95,-1.34) 8(2.95,-1.34)
FPC-SMD_P0.30-31P_FGS-XJ-H1.0
  rect 0.3x0.65 smd: 1(-4.5,-1.453) 2(-4.2,1.453) 3(-3.9,-1.453) 4(-3.6,1.453) 5(-3.3,-1.453) 6(-3,1.453) 7(-2.7,-1.453) 8(-2.4,1.453) 9(-2.1,-1.453) 10(-1.8,1.453) 11(-1.5,-1.453) 12(-1.2,1.453) 13(-0.9,-1.453) 14(-0.6,1.453) 15(-0.3,-1.453) 16(0,1.453) 17(0.3,-1.453) 18(0.6,1.453) 19(0.9,-1.453) 20(1.2,1.453) 21(1.5,-1.453) 22(1.8,1.453) 23(2.1,-1.453) 24(2.4,1.453) 25(2.7,-1.453) 26(3,1.453) 27(3.3,-1.453) 28(3.6,1.453) 29(3.9,-1.453) 30(4.2,1.453) 31(4.5,-1.453)
  rect 0.4x0.95 smd: 32(-5.15,-1.103) 33(5.15,-1.103)
HDMI-SMD_HDMI-19PIN-043
  rect 0.3x2.6 smd: 1(4.5,3.38) 2(4,3.38) 3(3.5,3.38) 4(3,3.38) 5(2.5,3.38) 6(2,3.38) 7(1.5,3.38) 8(1,3.38) 9(0.5,3.38) 10(0,3.38) 11(-0.5,3.38) 12(-1,3.38) 13(-1.5,3.38) 14(-2,3.38) 15(-2.5,3.38) 16(-3,3.38) 17(-3.5,3.38) 18(-4,3.38) 19(-4.5,3.38)
  oval 1.5x3.3 hole 0.9x2.7: 20(-7.25,2.62) 21(7.25,2.62)
  oval 1.5x2.3 hole 0.9x1.7: 22(-7.25,-3.38) 23(7.25,-3.38)
IND-SMD_L2.5-W2.0
  rect 1.2x2.2 smd: 1(1.028,0) 2(-1.028,0)
L0603
  rect 0.8x0.864 smd: 1(-0.7,0) 2(0.7,0)
LED0603-RD_RED
  rect 0.8x0.8 smd: 1(-0.799,-0.004) 2(0.799,0.004)
m3 125x300
  round 1 hole 1: 1(-2.5,0) 1(-1.768,1.768) 1(-1.768,-1.768) 1(0,2.5) 1(0,-2.5) 1(1.768,1.768) 1(2.5,0)
  round 6.5 hole 3.18x3.175: 1(0,0)
  round 1 hole 1.021x1: 1(1.768,-1.768)
OSC-SMD_4P-L3.2-W2.5-BL
  rect 1.4x1.2 smd: 1(-1.1,-0.875) 2(1.1,-0.875) 3(1.1,0.875) 4(-1.1,0.875)
QFN_64_7P5X7P5_0P4
  rect 0.762x0.241 smd: 1(-3.8,3) 2(-3.8,2.6) 3(-3.8,2.2) 4(-3.8,1.8) 5(-3.8,1.4) 6(-3.8,1) 7(-3.8,0.6) 8(-3.8,0.2) 9(-3.8,-0.2) 10(-3.8,-0.6) 11(-3.8,-1) 12(-3.8,-1.4) 13(-3.8,-1.8) 14(-3.8,-2.2) 15(-3.8,-2.6) 16(-3.8,-3) 33(3.8,-3) 34(3.8,-2.6) 35(3.8,-2.2) 36(3.8,-1.8) 37(3.8,-1.4) 38(3.8,-1) 39(3.8,-0.6) 40(3.8,-0.2) 41(3.8,0.2) 42(3.8,0.6) 43(3.8,1) 44(3.8,1.4) 45(3.8,1.8) 46(3.8,2.2) 47(3.8,2.6) 48(3.8,3)
  rect 0.241x0.762 smd: 17(-3,-3.8) 18(-2.6,-3.8) 19(-2.2,-3.8) 20(-1.8,-3.8) 21(-1.4,-3.8) 22(-1,-3.8) 23(-0.6,-3.8) 24(-0.2,-3.8) 25(0.2,-3.8) 26(0.6,-3.8) 27(1,-3.8) 28(1.4,-3.8) 29(1.8,-3.8) 30(2.2,-3.8) 31(2.6,-3.8) 32(3,-3.8) 49(3,3.8) 50(2.6,3.8) 51(2.2,3.8) 52(1.8,3.8) 53(1.4,3.8) 54(1,3.8) 55(0.6,3.8) 56(0.2,3.8) 57(-0.2,3.8) 58(-0.6,3.8) 59(-1,3.8) 60(-1.4,3.8) 61(-1.8,3.8) 62(-2.2,3.8) 63(-2.6,3.8) 64(-3,3.8)
  rect 5x5 smd: 65(0,0)
R0402
  rect 0.566x0.54 smd: 1(-0.433,0) 2(0.433,0)
R0603
  rect 0.806x0.864 smd: 1(-0.753,0) 2(0.753,0)
R0805
  rect 1.133x1.377 smd: 1(-1,0) 2(1,0)
SOD-323_L1.7-W1.3-LS2.6-RD-1
  rect 0.83x0.63 smd: 1(-1.14,0) 2(1.14,0)
SOT-23-3_L3.0-W1.7-P0.95-LS2.9-BR
  rect 1.038x0.532 smd: 1(1.101,-0.95) 2(1.101,0.95) 3(-1.101,0)
SOT-23-6_L2.9-W1.6-P0.95-LS2.8-BL
  rect 0.532x1.072 smd: 1(-0.95,-1.149) 2(0,-1.149) 3(0.95,-1.149) 4(0.95,1.149) 5(0,1.149) 6(-0.95,1.149)
TestPoint_D30
  round 0.762 smd: TP(0,0)

## Nets
As in the schematic.

Pads without a net: FPC1 4 5 6 24 25 26 27 28 29 30 31; HDMI1 14; U7 1 2 3 4 5 6 7 8 16 31 38 39 40 41 42 43 44 45 46 47 59 60 61 62 63 64

## Via types
v1: diameter 0.457, hole 0.254, Top Layer to Bottom Layer, 199 vias

## Routing (per net, layer and track width the routed paths; a pad name or vN(x,y) marks a point on that pad's centre or on a via; arc(x,y) is an arc through that point)
+5V0: length 114.5
  Top Layer w0.305: v1(31.92,64.4) 34.33,64.4 35.35,65.42 R3.2
  Top Layer w0.381: 31.02,41.17 R5.1 ; 31.02,41.17 R6.1 ; 31.02,41.17 v1(29.51,41.17) ; D2.1 v1(29.51,53.74) ; v1(11.08,31.57) 11.08,31.57 24.62,31.57 26.08,33.03 v1(26.08,39)
  Top Layer w0.508: T2.TP 10.21,23.25 7.93,25.53 v1(7.93,31.58) 7.93,58.19 12.11,62.37 v1(31.03,62.37) 31.92,61.48 v1(31.92,57.8)
  Bottom Layer w0.381: v1(29.51,53.74) 29.51,56.02 31.28,57.8 v1(31.92,57.8) ; v1(31.92,64.4) 31.92,63.26 v1(31.03,62.37) ; v1(7.93,31.58) 7.94,31.57 v1(11.08,31.57) ; v1(26.08,39) 27.34,39 v1(29.51,41.17)
GND: length 196.9
  Top Layer w0.254: 21.5,58.47 21.51,58.47 v1(21.51,60.59) ; 26,58.47 26,56.83 v1(25.7,56.53) ; 23,58.47 v1(23,60.59) ; 18.5,58.47 v1(18.5,60.59) ; 20,58.47 v1(20,60.59)
  Top Layer w0.305: FPC2.4 v1(40.05,46.8)
  Top Layer w0.381: v1(32.51,51.08) 33.79,51.08 ; 23.66,54.36 23.66,55.03 24.15,55.51 v1(24.86,55.51) 27.78,55.51 28.24,55.06 v1(28.24,53.49) 28.24,52.64 ; 23.66,54.36 23.67,54.36 24.88,54.36 ; 23.66,54.36 v1(23.66,53.49) 23.66,51.96 24.43,51.19 C10.2 24.61,51.01 24.94,50.69 24.94,49.42 24.43,48.91 v1(24.43,48.02) ; C16.2 v1(32.51,45.69) C6.1 ; 28.24,52.64 28.24,51.92 C11.2 27.51,49.83 26.08,48.4 v1(26.08,48.02) ; 28.24,52.64 28.22,52.61 27.09,52.61 ; C17.2 32.5,47.48 v1(32.51,47.49) 33.97,47.49 ; 33.79,49.28 v1(32.51,49.28) ; R13.2 v1(31.02,50.19) C9.2 ; 32.56,43.9 C7.1 33.83,42.25 U5.1 ; R4.1 32.49,38.51 v1(32.51,38.53) 33.97,38.53 ; 33.97,40.32 v1(32.51,40.32)
  Top Layer w0.508: C15.2 32.5,36.72 v1(32.51,36.73) ; C14.2 v1(11.1,43.07) C19.2 C18.2 v1(11.1,39.4) C12.2 v1(11.1,37.59) C13.2 ; C20.2 32,34.94 v1(32.51,34.43) ; C8.2 v1(11.1,50.18)
  Bottom Layer w0.152: v1(24.08,33.67) 23.95,33.8 22.65,33.8 22.4,33.54 ; v1(24.08,34.92) 22.25,34.92 22.01,34.69 21.38,34.69 21,35.07 ; 20.87,35.83 21.33,36.29 23.9,36.29 v1(24.08,36.1)
  Bottom Layer w0.381: v1(40.05,58.05) 36.64,58.05 34.96,56.38 34.96,44.53 27.78,37.35 v1(24.08,37.35) ; v1(40.05,55.26) 38.14,55.26 37.33,54.44 37.33,43.35 v1(32.51,38.53) 28.9,34.92 v1(24.08,34.92) ; v1(24.08,33.67) 24.15,33.6 29.38,33.6 v1(32.51,36.73) 38.47,42.69 38.47,53.17 39.22,53.93 v1(40.05,53.93) ; v1(40.05,56.66) 37.3,56.66 36.18,55.54 36.18,44 v1(32.51,40.32) 28.29,36.1 v1(24.08,36.1)
  vias: v1(2.3,60.62) v1(2.3,55.54) v1(2.3,50.46) v1(2.3,45.38) v1(2.3,40.3) v1(2.3,35.22) v1(2.3,30.14) v1(2.3,25.06) v1(2.3,19.98) v1(2.3,14.9) v1(2.3,9.82) v1(7.38,25.06) v1(7.38,19.98) v1(7.38,14.9) v1(7.38,9.82) v1(12.46,65.7) v1(12.46,55.54) v1(12.46,25.06) v1(12.46,14.9) v1(12.46,9.82) v1(12.46,4.74) v1(15.54,41.29) v1(15.54,25.73) v1(16.5,43.33) v1(17.06,29.88) v1(17.06,24.27) v1(17.54,65.7) v1(17.54,60.62) v1(17.54,35.22) v1(17.54,14.9) v1(17.54,9.82) v1(17.54,4.74) v1(17.62,43.33) v1(17.62,41.29) v1(17.78,54.66) v1(17.78,52) v1(18.33,38.11) v1(18.33,36.32) v1(18.33,34.53) v1(18.73,47.51) v1(19.59,48.32) v1(19.85,54.62) v1(19.85,51.96) v1(20.11,29.86) v1(20.69,48.94) v1(21.37,44.46) v1(21.37,43.33) v1(21.37,42.2) v1(21.35,32.44) v1(21.84,54.63) v1(21.84,51.8) v1(21.89,48.35) v1(22.5,44.46) v1(22.5,43.33) v1(22.5,42.19) v1(22.62,65.7) v1(22.62,30.14) v1(22.62,14.9) v1(22.62,9.82) v1(22.62,4.74) v1(23.1,48.34) v1(23.16,23.26) v1(23.16,22.24) v1(23.63,43.32) v1(23.63,42.19) v1(24.08,38.62) v1(24.08,32.15) v1(24.17,56.28) v1(25.19,23.26) v1(27.7,65.7) v1(27.7,19.98) v1(27.7,14.9) v1(27.7,9.82) v1(27.7,4.74) v1(29.25,31.64) v1(30.78,31.64) v1(30.78,29.86) v1(32.3,31.64) v1(32.3,25.8) v1(32.51,43.9) v1(32.78,65.7) v1(32.78,50.46) v1(32.78,25.06) v1(32.78,19.98) v1(32.78,14.9) v1(32.78,9.82) v1(32.78,4.74) v1(37.86,60.62) v1(37.86,30.14) v1(37.86,25.06) v1(37.86,19.98) v1(37.86,14.9) v1(37.86,9.82) v1(39.92,50.35) v1(39.92,49.42) v1(40.05,59.45) v1(40.05,52.59) v1(42.94,30.14) v1(42.94,25.06) v1(42.94,19.98) v1(42.94,14.9) v1(42.94,9.82)
VDD_1V8: length 129.4
  Top Layer w0.203: U7.36 15.56,45.13 14.33,43.89 C14.1 ; U7.11 27.11,44.33 27.53,43.9 27.53,37.93 28.75,36.72 C15.1 30.39,35.85 v1(34.59,35.85)
  Top Layer w0.381: T4.TP 13,30.37 13.6,30.97 32.9,30.97 v1(36.11,34.18) ; 12.64,43.85 11.71,44.77 9.19,44.77 ; B2.1 v1(30.97,44.72)
  Top Layer w0.508: 9.19,34.96 9.19,30.62 10.71,29.1 T4.TP ; 9.19,34.96 9.22,34.92 B1.1 ; 9.19,34.96 9.19,57.67 13.12,61.61 30.27,61.61 31.16,60.72 31.16,57.29 v1(31.92,56.53)
  Bottom Layer w0.381: v1(30.97,44.72) 31.92,45.67 v1(31.92,56.53) ; v1(34.59,35.85) 34.59,34.94 35.35,34.18 v1(36.11,34.18)
VDD_1V8_RX: length 10.5
  Top Layer w0.203: B1.2 12.61,34.98 C13.1 C12.1 12.61,38.61 14.32,40.33 U7.48
VDD_1V8_TX: length 9.5
  Top Layer w0.203: v1(24.97,46.35) 24.7,46.62 U7.19
  Top Layer w0.381: B2.2 29.52,43.94 C16.1 C17.1 29.42,47.39 v1(28.49,47.39)
  Bottom Layer w0.203: v1(28.49,47.39) 27.46,46.35 v1(24.97,46.35)
VDD_3V3: length 184.1
  Top Layer w0.203: FPC2.5 37.78,47.3 37.18,47.89 36.57,47.89 36.22,47.54 36.22,46.57 C6.2 ; 15.55,43.9 16.38,44.73 U7.37 ; U7.10 26.31,43.93 26.93,43.93 27.21,43.66 27.21,37.25 C20.1
  Top Layer w0.254: C6.2 C7.2
  Top Layer w0.305: 42.38,47.82 42.72,47.49 42.72,47.39 ; 42.38,47.82 40.12,47.82 39.6,47.3 FPC2.5 ; 42.38,47.82 42.84,47.82 ; 42.38,47.82 42.72,48.15 ; FPC1.2 40.93,51.12 ; FPC1.1 42.46,51.95 ; FPC1.3 42.8,52.55 42.33,52.08 ; C18.1 C19.1 13.75,42.1 15.55,43.9
  Top Layer w0.381: v1(32.56,53.74) 32.56,52.97 32.3,52.72 D1.1 ; R9.1 35.34,35.28 35.26,35.19 ; 35.26,35.19 34.28,35.19 32.76,33.67 30.01,33.67 29.52,34.17 C20.1 ; 35.26,35.19 42.72,35.19 ; U1.4 v1(24.24,23.26) ; v1(32.56,57.17) 36.24,57.17 ; 42.73,35.7 42.84,35.81
  Top Layer w0.508: R8.1 v1(11.1,48.41) R10.1 R11.1 ; 32.27,22.23 C3.2 ; R12.1 v1(11.1,52.21)
  Top Layer w0.762: v1(6.39,41.29) v1(6.39,48.41) v1(6.39,52.21) 6.39,58.56 11.22,63.39 32.56,63.39 36.37,59.58 36.37,53.23 35.34,52.2 C1.2 ; C1.2 35.55,51.29 41.89,51.29 42.33,51.73 ; C1.2 C2.2 ; 42.33,52.08 42.33,51.73 ; 42.33,51.73 42.33,51.58 ; T1.TP 39.16,28.84 42.84,32.53 42.84,50.49 42.07,51.26
  Bottom Layer w0.381: v1(24.24,23.26) 25.25,22.24 v1(26.97,22.24) ; v1(32.56,53.74) v1(32.56,57.17)
  Bottom Layer w0.508: v1(11.1,48.41) v1(6.39,48.41) ; v1(11.1,52.21) v1(6.39,52.21) ; v1(12.62,41.29) 12.61,41.29 v1(6.39,41.29)
DSI_CLK_N: length 42.4
  Top Layer w0.158: v1(42.46,55.64) 42.25,55.85 FPC1.14 ; v1(21.76,35.19) 21.75,35.19 20.95,35.99 20.95,38.32 21.17,38.54 21.17,38.92 21.1,38.99 U7.53
  Bottom Layer w0.158: v1(21.76,35.19) 21.78,35.19 21.96,35.38 28.66,35.38 36.87,43.59 36.87,55.02 37.68,55.83 41.89,55.83 42.07,55.64 v1(42.46,55.64)
DSI_CLK_P: length 42.3
  Top Layer w0.158: v1(42.46,56.28) 42.59,56.15 FPC1.15 ; v1(21.76,35.83) 21.48,35.83 21.21,36.1 21.21,36.44 21.39,36.61 21.39,36.91 21.21,37.09 21.21,38.22 21.43,38.44 21.43,38.92 21.5,38.99 U7.54
  Bottom Layer w0.158: v1(42.46,56.28) 42.07,56.28 41.89,56.09 41.12,56.09 40.94,56.27 40.64,56.27 40.47,56.09 37.57,56.09 36.61,55.13 36.61,43.7 28.56,35.64 23.87,35.64 23.68,35.83 23.39,35.83 23.21,35.64 22.92,35.64 22.73,35.83 22.45,35.83 22.26,35.64 21.95,35.64 v1(21.76,35.83)
DSI_D0_N: length 45.7
  Top Layer w0.158: v1(42.46,54.24) 42.48,54.24 43.18,54.95 FPC1.11 ; v1(19.6,33.92) 19.73,33.92 20.47,34.67 20.47,38.22 20.63,38.38 20.63,38.92 20.7,38.99 U7.52
  Bottom Layer w0.158: v1(42.46,54.24) 42.07,54.24 41.89,54.43 38.57,54.43 38.02,53.88 38.02,42.89 29.28,34.14 19.83,34.14 19.61,33.92 v1(19.6,33.92)
DSI_D0_P: length 45.7
  Top Layer w0.158: FPC1.12 42.09,55.25 v1(42.46,54.88) ; U7.51 20.3,38.99 20.37,38.92 20.37,38.49 20.21,38.33 20.21,34.78 20,34.56 19.6,34.56 v1(19.6,34.56)
  Bottom Layer w0.158: v1(19.6,34.56) 19.76,34.4 20.1,34.4 20.28,34.58 20.57,34.58 20.75,34.4 29.17,34.4 37.76,42.99 37.76,53.98 38.46,54.69 40.64,54.69 arc(40.77,54.75) 40.82,54.88 arc(40.88,55.01) 41.01,55.06 41.11,55.06 arc(41.24,55.01) 41.3,54.88 arc(41.35,54.75) 41.48,54.69 41.89,54.69 42.07,54.88 v1(42.46,54.88)
DSI_D1_N: length 43.6
  Top Layer w0.158: U7.49 19.5,38.99 19.57,38.92 19.57,38.69 19.09,38.21 19.09,36.83 19.42,36.51 19.43,36.51 v1(19.6,36.34) ; FPC1.17 42.75,56.75 v1(42.46,57.04)
  Bottom Layer w0.158: v1(19.6,36.34) 19.62,36.34 19.84,36.56 28.06,36.56 35.74,44.23 35.74,55.92 37.05,57.23 41.88,57.23 42.07,57.04 v1(42.46,57.04)
DSI_D1_P: length 43.5
  Top Layer w0.158: U7.50 19.9,38.99 19.83,38.92 19.83,38.58 19.35,38.1 19.35,37.23 v1(19.61,36.97) ; v1(42.46,57.69) 41.82,57.05 FPC1.18
  Bottom Layer w0.158: v1(19.61,36.97) 19.76,36.82 20.16,36.82 20.34,37 20.63,37 20.81,36.82 21.1,36.82 21.28,37 21.58,37 21.75,36.82 22.05,36.82 22.23,37 22.52,37 22.7,36.82 27.96,36.82 35.48,44.34 35.48,56.02 36.95,57.49 41.88,57.49 42.07,57.69 v1(42.46,57.69)
DSI_D2_N: length 40.7
  Top Layer w0.158: v1(42.46,58.44) 41.68,57.65 FPC1.20 ; U7.56 22.3,38.99 22.23,38.92 22.23,37.95 22.22,37.94 22.22,37.92 21.95,37.66 21.94,37.66 v1(21.76,37.48)
  Bottom Layer w0.158: v1(42.46,58.44) 42.07,58.44 41.89,58.62 36.41,58.62 34.47,56.68 34.47,44.72 27.6,37.86 22.15,37.86 21.78,37.48 v1(21.76,37.48)
DSI_D2_P: length 40.6
  Top Layer w0.158: v1(42.46,59.07) 42.48,59.07 43.59,57.95 FPC1.21 ; v1(21.76,38.11) 21.97,38.33 21.97,38.92 21.9,38.99 U7.55
  Bottom Layer w0.158: v1(21.76,38.11) 22.56,38.11 22.74,38.29 23.03,38.29 23.21,38.11 24.59,38.11 24.77,38.29 25.06,38.29 25.24,38.11 27.49,38.11 34.21,44.83 34.21,56.78 36.3,58.88 37.32,58.88 37.5,59.06 37.79,59.06 37.97,58.88 38.26,58.88 38.44,59.06 38.74,59.06 38.91,58.88 39.21,58.88 39.38,59.06 39.68,59.06 39.86,58.88 40.59,58.88 40.77,59.06 41.07,59.06 41.24,58.88 41.89,58.88 42.07,59.07 v1(42.46,59.07)
DSI_D3_N: length 43.2
  Top Layer w0.158: v1(23.28,32.65) 23.27,32.65 22.82,33.1 22.82,38.86 22.7,38.99 U7.57 ; FPC1.8 41.37,54.05 42.27,53.15 42.29,53.15 v1(42.46,52.97)
  Bottom Layer w0.158: v1(42.46,52.97) 42.07,52.97 41.89,53.16 39.6,53.16 39.16,52.72 39.16,41.94 30.06,32.84 23.49,32.84 23.3,32.65 v1(23.28,32.65)
DSI_D3_P: length 43.2
  Top Layer w0.158: FPC1.9 43.22,54.35 42.52,53.66 42.51,53.66 v1(42.46,53.61) ; v1(23.28,33.29) 23.08,33.49 23.08,34.78 23.26,34.96 23.26,35.25 23.08,35.43 23.08,35.73 23.26,35.9 23.26,36.2 23.08,36.38 23.08,36.67 23.26,36.85 23.26,37.14 23.08,37.32 23.08,37.62 23.26,37.79 23.26,38.09 23.08,38.27 23.08,39.51 U7.58
  Bottom Layer w0.158: v1(42.46,53.61) 42.07,53.61 41.89,53.42 41.6,53.42 arc(41.43,53.49) 41.36,53.66 41.36,53.67 arc(41.13,53.9) 40.89,53.67 40.89,53.66 arc(40.82,53.49) 40.66,53.42 39.49,53.42 38.9,52.83 38.9,42.05 29.95,33.1 23.47,33.1 v1(23.28,33.29)
HDMI_CEC: length 37.7
  Top Layer w0.203: U7.26 v1(21.9,46.37) ; 24,58.47 24,60.17 24.55,60.72 27.73,60.72 28.11,60.34 28.11,58.39 30.61,55.89 34.93,55.89 35.6,55.22 35.6,54.13 R7.1 33.58,53.11 31.92,51.45 31.92,48.78 31.54,48.4 28.87,48.4 v1(28.49,48.02)
  Bottom Layer w0.203: v1(21.9,46.37) 24.06,48.53 27.98,48.53 v1(28.49,48.02)
HDMI_CLK_N: length 12.3
  Top Layer w0.158: 23.5,58.47 23.5,57.01 23.13,56.64 23.13,55.25 22.72,54.84 22.72,54.4 22.84,54.28 U9.6 U9.5 22.84,52.43 22.72,52.31 22.72,51.54 23.83,50.43 23.83,47.73 23.9,47.66 U7.21
HDMI_CLK_P: length 12.3
  Top Layer w0.158: U7.22 23.5,47.66 23.57,47.73 23.57,50.32 22.46,51.43 22.46,52.31 22.34,52.43 U9.4 U9.7 22.34,54.28 22.46,54.4 22.46,54.95 22.87,55.36 22.87,56.64 22.5,57.01 22.5,58.47
HDMI_CSCL: length 41.6
  Top Layer w0.203: v1(14.65,46.64) 14.65,47.48 14.64,47.49 ; FPC2.1 37.66,45.3 37.05,44.69 T8.TP 37.05,40.37 U3.2 34.66,39.08 34.66,39.09 34.51,39.24 34.5,39.24 34.35,39.39 32.68,39.39 31.92,40.15 31.92,42.57 31.43,43.07 v1(30.27,43.07) ; 14.64,47.49 R10.2 ; 14.64,47.49 15.69,47.49 17.25,45.93 U7.34
  Bottom Layer w0.203: v1(30.27,43.07) 29.63,43.7 24.81,43.7 23.41,45.1 16.18,45.1 v1(14.65,46.64)
HDMI_CSDA: length 40.2
  Top Layer w0.203: 15.57,45.53 15.54,45.56 v1(15.54,46.62) ; 15.57,45.53 U7.35 ; 15.57,45.53 12.78,45.53 R11.2 ; v1(32.56,44.72) 31.79,43.96 31.79,43.22 32.3,42.71 32.3,41.8 32.87,41.23 34.3,41.23 34.5,41.03 34.51,41.03 34.66,40.88 34.66,40.88 U4.2 36.42,41.53 36.42,44.95 T7.TP 37.26,45.8 FPC2.2
  Bottom Layer w0.203: v1(32.56,44.72) 31.92,44.08 24.94,44.08 23.54,45.48 16.68,45.48 v1(15.54,46.62)
HDMI_D0_N: length 12.4
  Top Layer w0.158: U7.24 22.7,47.66 22.63,47.73 22.63,49.87 21.22,51.27 21.22,52.31 21.34,52.43 U9.2 U9.9 21.34,54.28 21.22,54.4 21.22,54.87 21.63,55.27 21.63,56.64 22,57.01 22,58.47
HDMI_D0_P: length 12.4
  Top Layer w0.158: 21,58.47 21,57.01 21.37,56.64 21.37,55.38 20.96,54.97 20.96,54.4 20.84,54.28 U9.10 U9.1 20.84,52.43 20.96,52.31 20.96,51.17 22.37,49.76 22.37,47.73 22.3,47.66 U7.25
HDMI_D1_N: length 13.4
  Top Layer w0.158: 20.5,58.47 20.5,57.01 20.13,56.64 20.13,56.38 18.66,54.91 18.66,54.4 18.78,54.28 U8.6 U8.5 18.78,52.43 18.68,52.33 18.68,52.11 21.43,49.36 21.43,47.73 21.5,47.66 U7.27
HDMI_D1_P: length 13.4
  Top Layer w0.158: 19.5,58.47 19.5,57.01 19.87,56.64 19.87,56.48 18.4,55.01 18.4,54.4 18.28,54.28 U8.7 U8.4 18.28,52.43 18.4,52.31 18.4,52.02 21.17,49.25 21.17,47.73 21.1,47.66 U7.28
HDMI_D2_N: length 13.7
  Top Layer w0.158: U7.29 20.7,47.66 20.63,47.73 20.63,48.35 17.16,51.82 17.16,52.31 17.28,52.43 U8.2 U8.9 17.28,54.28 17.16,54.4 17.16,54.91 18.63,56.38 18.63,56.64 19,57.01 19,58.47
HDMI_D2_P: length 13.7
  Top Layer w0.158: 18,58.47 18,57.01 18.37,56.64 18.37,56.48 16.9,55.01 16.9,54.4 16.78,54.28 U8.10 U8.1 16.78,52.43 16.9,52.31 16.9,51.71 20.37,48.24 20.37,47.73 20.3,47.66 U7.30
HDMI_HPD: length 29.5
  Top Layer w0.203: v1(30.78,51.96) 30.27,52.47 30.27,55.33 28.87,56.73 27.24,56.73 27,56.97 27,58.47 ; v1(25.44,44.97) 25.6,45.13 U7.13 27.32,45.13 28.18,44.27 28.18,39.85 R4.2
  Bottom Layer w0.203: v1(30.78,51.96) 30.27,51.45 30.27,46.75 28.75,45.23 25.7,45.23 v1(25.44,44.97)
HDMI_INT: length 35.7
  Top Layer w0.203: 37,46.3 36.71,46.3 36.04,45.62 36.04,42.94 U5.2 ; 37,46.3 37.04,46.34 T6.TP ; 37,46.3 FPC2.3 39.62,46.3 39.92,45.99 39.92,41.32 v1(37.13,38.53) 36.2,37.6 33.84,37.6 ; 33.84,37.6 33.83,37.59 R9.2 ; 33.84,37.6 29.13,37.6 27.85,38.89 27.85,44.09 27.22,44.73 U7.12
HDMI_RSTN: length 37
  Top Layer w0.203: U6.2 34.66,46.94 34.66,46.93 34.51,46.78 34.5,46.78 34.34,46.62 v1(31.03,46.62) ; U6.2 35.49,47.82 ; U6.2 36.32,48.61 T5.TP 37.12,48.61 37.93,47.8 FPC2.6 ; C8.1 R8.2 14.91,49.28 v1(15.54,48.66) 17.87,46.33 U7.33
  Top Layer w0.305: 35.21,47.53 U6.2
  Bottom Layer w0.203: v1(15.54,48.66) 15.54,47.51 17.19,45.86 23.66,45.86 25.06,44.47 28.87,44.47 v1(31.03,46.62)
HDMI_SCL: length 22.3
  Top Layer w0.203: R6.2 28.86,42.75 28.86,44.99 27.92,45.93 ; v1(28.87,51.96) 28.87,55.01 27.94,55.94 25.4,55.94 25,56.34 25,58.47 ; 27.92,45.93 v1(28.49,46.5) ; 27.92,45.93 U7.15
  Bottom Layer w0.203: v1(28.49,46.5) 29.13,47.13 29.13,51.7 v1(28.87,51.96)
HDMI_SDA: length 31.8
  Top Layer w0.203: v1(25.44,45.73) 25.65,45.53 U7.14 27.69,45.53 28.52,44.69 28.52,41.3 R5.2 ; 25.5,58.47 25.5,60.02 25.82,60.34 27.3,60.34 27.62,60.02 27.62,58.45 30.78,55.29 v1(30.78,52.97)
  Bottom Layer w0.203: v1(30.78,52.97) 29.63,51.83 29.63,46.88 28.49,45.73 v1(25.44,45.73)
LT9611_XTALI: length 6
  Top Layer w0.203: U7.18 25.1,48.69 25.63,49.22 R14.1 25.48,50.07 C10.1 25.48,52.02 24.88,52.61
LT9611_XTALO: length 8.4
  Top Layer w0.203: 27.09,54.36 25.99,53.27 25.99,51.84 C11.1 26.64,50.07 R14.2 26.49,49.45 25.5,48.46 U7.17
$1N2490: length 5.7
  Top Layer w0.381: R1.1 R2.2 21.81,24.43 U1.3
$1N7398: length 2.3
  Top Layer w0.203: 33.11,67.95 LED1.2
  Top Layer w0.305: R3.1 33.11,67.95
$2N1397: length 3
  Top Layer w0.203: R7.2 34.2,55 D1.2
$2N1417: length 7.8
  Top Layer w0.203: R13.1 28.48,49.28 27.6,48.4 v1(27.6,48.02) ; U7.20 24.3,46.61 v1(24.05,46.35)
  Bottom Layer w0.203: v1(27.6,48.02) 26.59,47 24.7,47 v1(24.05,46.35)
$2N1418: length 9.9
  Top Layer w0.203: C9.1 28.62,51.07 28.11,50.56 28.11,49.55 26.84,48.28 v1(26.84,48.02) ; 23.1,47.12 v1(23.1,46.35)
  Bottom Layer w0.203: v1(26.84,48.02) 26.21,47.39 24.13,47.39 v1(23.1,46.35)
$2N1427: length 18.4
  Top Layer w0.203: v1(25.44,43.02) 25.44,43.13 25.81,43.5 26.28,43.5 U7.9 ; T3.TP 33.32,32.91 29.76,32.91 26.71,35.96 v1(26.71,39.77)
  Bottom Layer w0.203: v1(25.44,43.02) 26.71,41.75 v1(26.71,39.77)
$2N1432: length 9.7
  Top Layer w0.203: U7.32 19.5,47.6 18.44,48.66 17.18,48.66 R12.2
$3N691: length 5.7
  Top Layer w0.254: 26.59,56.53 26.5,56.62
  Top Layer w0.305: 26.5,56.62 26.5,58.47
  Top Layer w0.381: 29.63,55 28.3,56.34 26.78,56.34 26.59,56.53

## Copper pours and planes (outline as drawn; the poured copper is in the pictures)
+5V0 on Top Layer: 25.7,22.49 25.44,22.75 24.94,22.75 24.68,22.49 24.68,21.22 24.43,20.97 20.87,20.97 20.36,21.48 20.36,23 20.11,23.26 14.52,23.26 13.76,24.02 12.24,24.02 11.98,23.76 11.98,19.95 12.74,19.19 24.94,19.19 25.7,19.95
GND on Top Layer: -4.28,72.79 47.54,72.79 47.54,-3.41 -4.28,-3.41
GND on Bottom Layer: -4.78,72.53 49.57,72.53 49.57,-4.18 -4.78,-4.18
VDD_1V8 on Top Layer: 14.52,28.84 13.5,29.86 12.49,29.86 11.98,29.35 11.98,26.81 12.49,26.3 24.43,26.3 25.19,27.07 25.19,28.47 24.81,28.84
VDD_3V3 on Top Layer: 34.08,29.61 33.32,28.84 28.49,28.84 27.47,29.86 25.7,29.86 25.44,29.61 25.44,26.81 25.7,26.56 33.32,26.56 33.57,26.3 33.57,23.51 33.32,23.26 26.08,23.26 25.87,23.04 25.87,21.06 26.21,20.72 35.09,20.72 36.11,21.73 36.11,29.1 35.6,29.61
$1N1708 on Top Layer: 26.21,26.05 25.7,25.54 25.7,23.76 25.95,23.51 30.52,23.51 30.78,23.76 30.78,25.8 30.52,26.05

Small or netless copper shapes (teardrops, artwork), in the pictures only: 216 on Top Layer, 43 on Bottom Layer

## Text on the board
Bottom Silkscreen Layer: 广告位招租 | 卖板不赚钱
Top Solder Mask Layer: 【V1.0.1】
Top Silkscreen Layer: 31PIN-MIPI | HDMI | I2C | LT9611 | 立创·MIPI转HDMI扩展板
